# Altium project Lancelot_prj.PrjPCB (part 1 of 2)
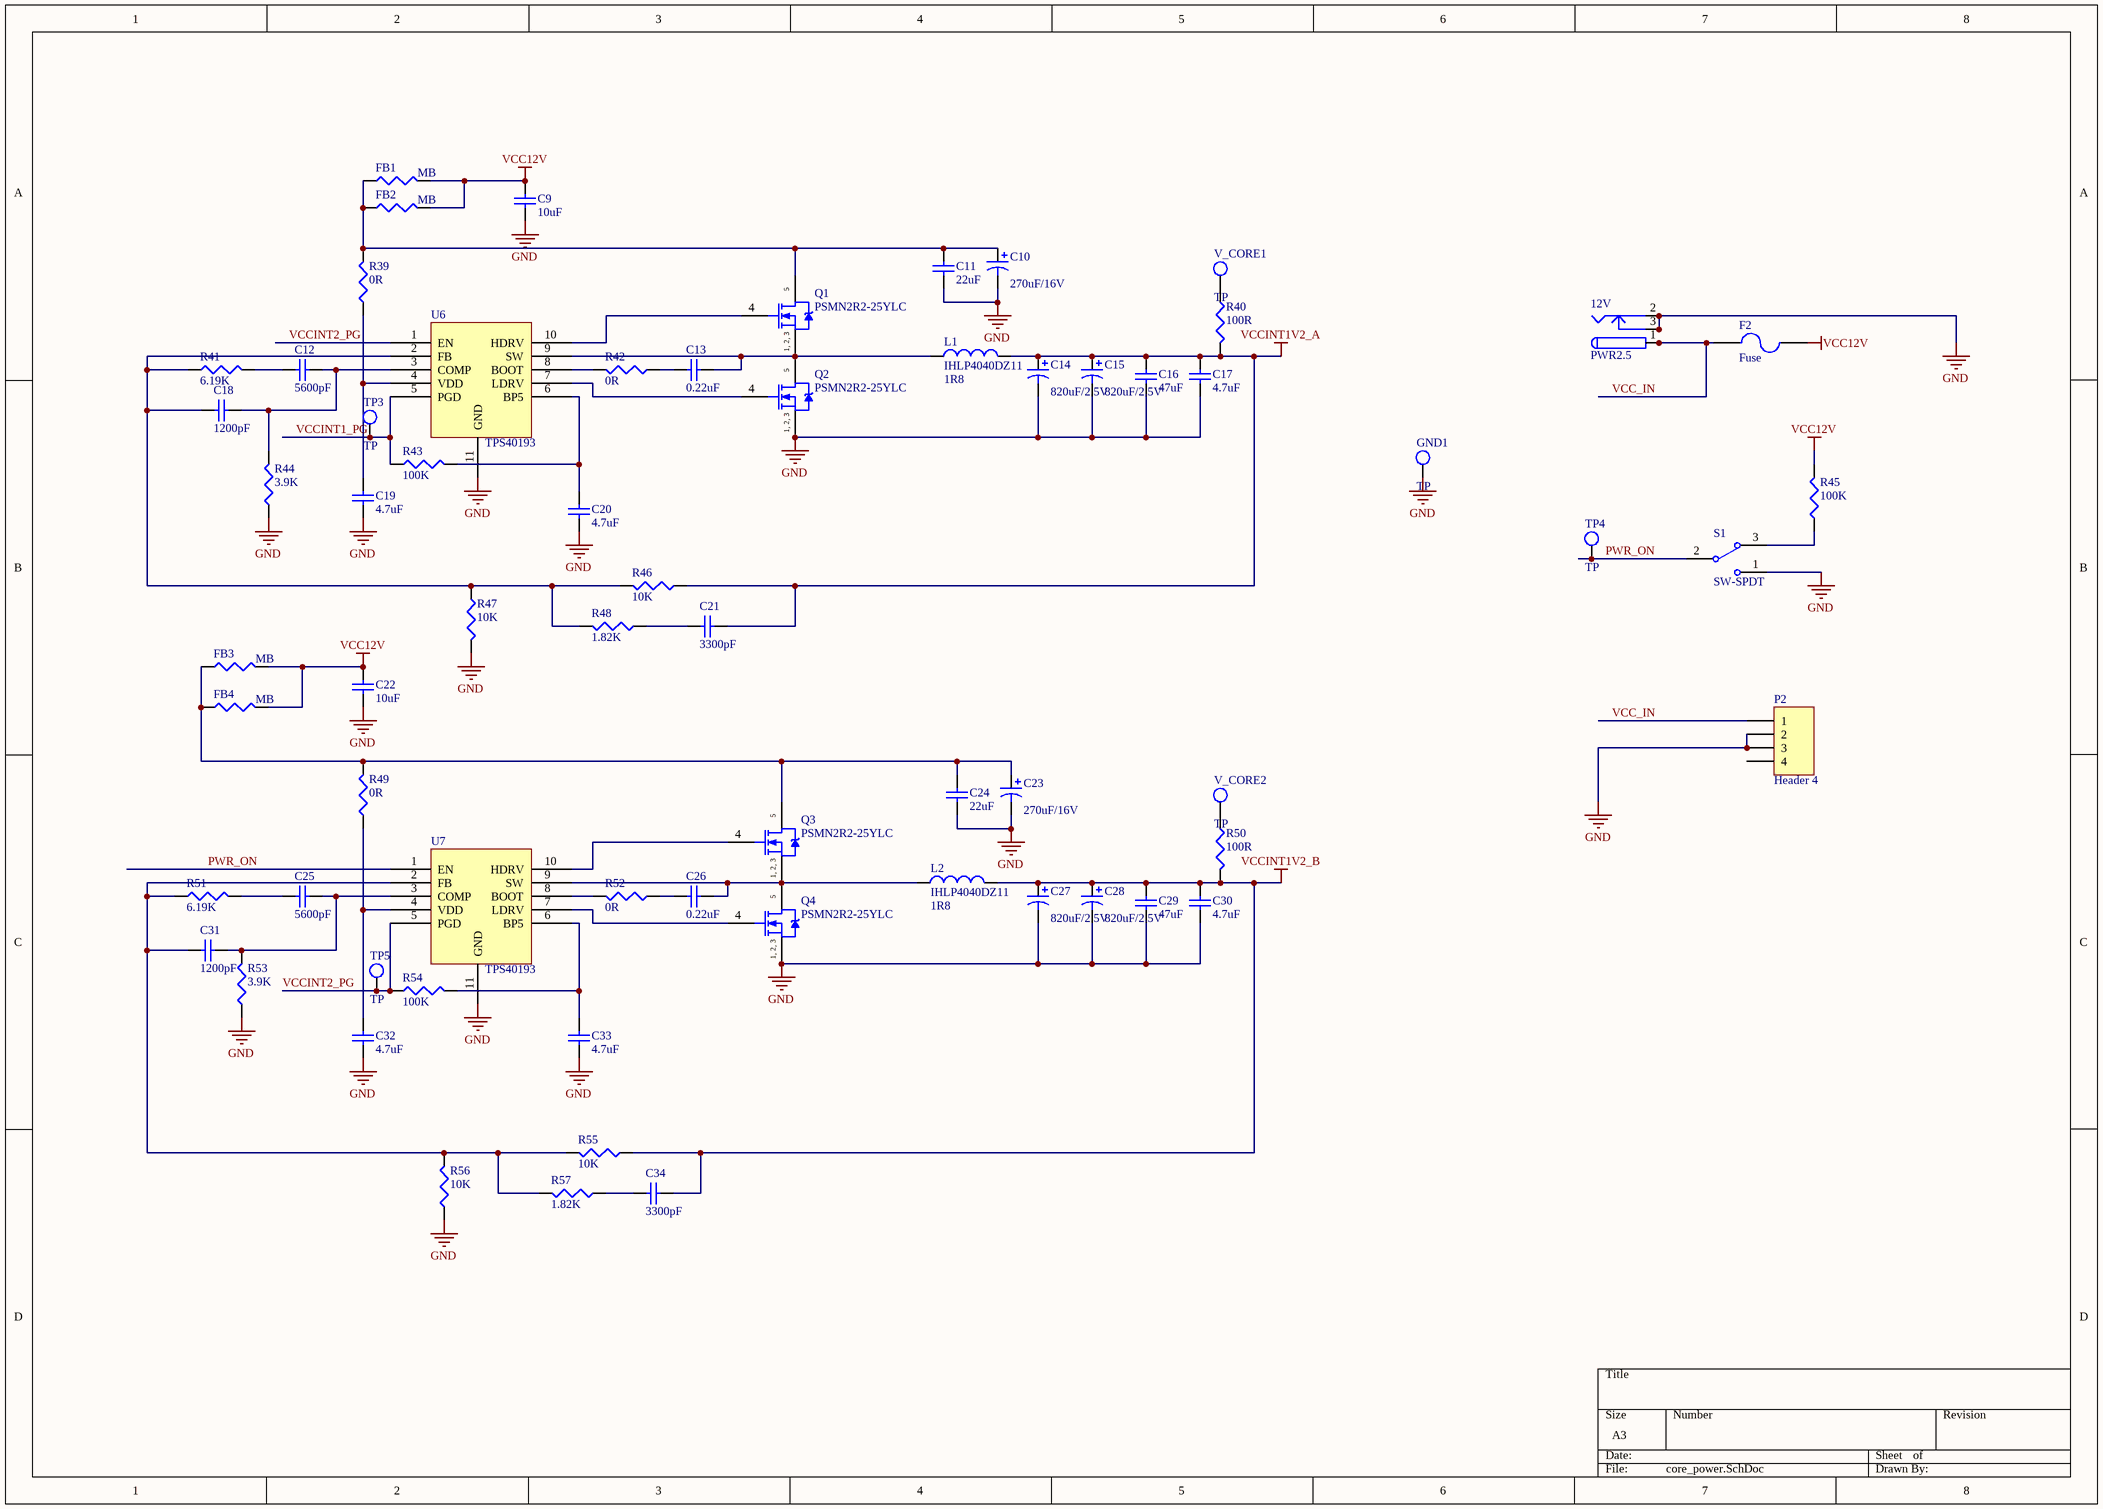
[diagram p0: core_power.SchDoc]
11 sheets, 372 parts. Net scope: global (net labels, ports and power ports of the same name join across sheets).
Board file: Lancelot.PcbDoc
Sheets:
  core_power.SchDoc
  io_power.SchDoc
  clock.SchDoc
  USB_UART.SchDoc
  peripherals.SchDoc
  config.SchDoc
  FPGA1.SchDoc
  FPGA2.SchDoc
  FPGA1_PWR.SchDoc
  FPGA2_PWR.SchDoc
  connector.SchDoc

## Sheet core_power.SchDoc
size A3

### Parts
12V  PWR2.5  [KLD-0202]
C9  10uF  [CAPC3216N]
C10  270uF/16V  [CAP8X8]
C11  22uF  [CAPC3225N]
C12  5600pF  [CAPC1608N]
C13  0.22uF  [CAPC1608N]
C14  820uF/2.5V  [CAP8X8]
C15  820uF/2.5V  [CAP8X8]
C16  47uF  [CAPC3225N]
C17  4.7uF  [CAPC1608N]
C18  1200pF  [CAPC1608N]
C19  4.7uF  [CAPC2012N]
C20  4.7uF  [CAPC2012N]
C21  3300pF  [CAPC1608N]
C22  10uF  [CAPC3216N]
C23  270uF/16V  [CAP8X8]
C24  22uF  [CAPC3225N]
C25  5600pF  [CAPC1608N]
C26  0.22uF  [CAPC1608N]
C27  820uF/2.5V  [CAP8X8]
C28  820uF/2.5V  [CAP8X8]
C29  47uF  [CAPC3225N]
C30  4.7uF  [CAPC1608N]
C31  1200pF  [CAPC1608N]
C32  4.7uF  [CAPC2012N]
C33  4.7uF  [CAPC2012N]
C34  3300pF  [CAPC1608N]
F2  Fuse  [RESC5025N]
FB1  MB  [INDC3216N]
FB2  MB  [INDC3216N]
FB3  MB  [INDC3216N]
FB4  MB  [INDC3216N]
GND1  TP  [PIN1]
L1  IHLP4040DZ11  value 1R8  [IHLP4040]
L2  IHLP4040DZ11  value 1R8  [IHLP4040]
P2  Header 4  [015244441]
Q1  PSMN2R2-25YLC  [LFPAK]
Q2  PSMN2R2-25YLC  [LFPAK]
Q3  PSMN2R2-25YLC  [LFPAK]
Q4  PSMN2R2-25YLC  [LFPAK]
R39  0R  [RESC1608N]
R40  100R  [RESC1005N]
R41  6.19K  [RESC1608N]
R42  0R  [RESC1608N]
R43  100K  [RESC1005N]
R44  3.9K  [RESC1608N]
R45  100K  [RESC1005N]
R46  10K  [RESC1608N]
R47  10K  [RESC1608N]
R48  1.82K  [RESC1608N]
R49  0R  [RESC1608N]
R50  100R  [RESC1005N]
R51  6.19K  [RESC1608N]
R52  0R  [RESC1608N]
R53  3.9K  [RESC1608N]
R54  100K  [RESC1005N]
R55  10K  [RESC1608N]
R56  10K  [RESC1608N]
R57  1.82K  [RESC1608N]
S1  SW-SPDT  [SW3_S]
TP3  TP  [TP]
TP4  TP  [TP]
TP5  TP  [TP]
U6  TPS40193  [SON10]
U7  TPS40193  [SON10]
V_CORE1  TP  [PIN1]
V_CORE2  TP  [PIN1]

### Nets
GND: 12V.2 12V.2A 12V.2B 12V.3 12V.3A 12V.3B C9.1 C10.2 C11.1 C14.2 C15.2 C16.1 C17.1 C19.2 C20.1 C22.1 C23.2 C24.1 C27.2 C28.2 C29.1 C30.1 C32.1 C33.2 GND1.1(TP) P2.2 P2.3 Q2.1(S) Q2.2(S) Q2.3(S) Q4.1(S) Q4.2(S) Q4.3(S) R44.1 R47.2 R53.1 R56.1 S1.1 U6.11(GND) U7.11(GND)
VCC12V: C9.2 C22.2 F2.2 FB1.2 FB2.2 FB3.2 FB4.2 R45.2
VCCINT1V2_A: C14.1 C15.1 C16.2 C17.2 C21.2 L1.2 R40.2 R46.1
VCCINT1V2_B: C27.1 C28.1 C29.2 C30.2 C34.2 L2.2 R50.2 R55.1
PWR_ON: S1.2 TP4.1(TP) U7.1(EN)
VCC_IN: 12V.1 12V.1A 12V.1B F2.1 P2.1
VCCINT1_PG: R43.1 TP3.1(TP) U6.5(PGD)
VCCINT2_PG: R54.1 TP5.1(TP) U6.1(EN) U7.5(PGD)
NetC10_1: C10.1 C11.2 FB1.1 FB2.1 Q1.5(D) R39.2
NetC12_1: C12.1 C18.1 R44.2 U6.3(COMP)
NetC12_2: C12.2 R41.2
NetC13_1: C13.1 L1.1 Q1.1(S) Q1.2(S) Q1.3(S) Q2.5(D) U6.9(SW)
NetC13_2: C13.2 R42.1
NetC18_2: C18.2 R41.1 R46.2 R47.1 R48.2 U6.2(FB)
NetC19_1: C19.1 R39.1 U6.4(VDD)
NetC20_2: C20.2 R43.2 U6.6(BP5)
NetC21_1: C21.1 R48.1
NetC23_1: C23.1 C24.2 FB3.1 FB4.1 Q3.5(D) R49.2
NetC25_1: C25.1 C31.1 R53.2 U7.3(COMP)
NetC25_2: C25.2 R51.2
NetC26_1: C26.1 L2.1 Q3.1(S) Q3.2(S) Q3.3(S) Q4.5(D) U7.9(SW)
NetC26_2: C26.2 R52.1
NetC31_2: C31.2 R51.1 R55.2 R56.2 R57.2 U7.2(FB)
NetC32_2: C32.2 R49.1 U7.4(VDD)
NetC33_1: C33.1 R54.2 U7.6(BP5)
NetC34_1: C34.1 R57.1
NetQ1_4: Q1.4(G) U6.10(HDRV)
NetQ2_4: Q2.4(G) U6.7(LDRV)
NetQ3_4: Q3.4(G) U7.10(HDRV)
NetQ4_4: Q4.4(G) U7.7(LDRV)
NetR40_1: R40.1 V_CORE1.1(TP)
NetR42_2: R42.2 U6.8(BOOT)
NetR45_1: R45.1 S1.3
NetR50_1: R50.1 V_CORE2.1(TP)
NetR52_2: R52.2 U7.8(BOOT)

Not connected (* = marked no-connect by the designer): P2 4

### Notes on the sheet
- (in symbol HAT216X) 1, 2, 3

### Library data of the parts
12V = PWR2.5: Low Voltage Power Supply Connector; Published: 17-Dec-2003; DatasheetDocument: 09-May-2002; Publisher: Altium Limited; ComponentLink1Description: Manufacturer Link; ComponentLink1URL: http://domino.kycon.com/internet/Products.html
C9 C11-C13 C16-C22 C24-C26 C29-C34 = Cap Semi: Capacitor (Semiconductor SIM Model); Published: 8-Jun-2000; LatestRevisionDate: 29-May-2009; LatestRevisionNote: IPC-7351 Footprint Added.; PackageReference: C1206; Publisher: Altium Limited; PackageDescription: Chip Capacitor
  C9 C22: Value: 10uF
  C11 C24: Value: 22uF
  C12 C25: Value: 5600pF
  C13 C26: Value: 0.22uF
  C16 C29: Value: 47uF
  C17 C19 C20 C30 C32 C33: Value: 4.7uF
  C18 C31: Value: 1200pF
  C21 C34: Value: 3300pF
C10 C14 C15 C23 C27 C28 = Cap Pol1: Polarized Capacitor (Radial); Published: 8-Jun-2000; LatestRevisionDate: 17-Jul-2002; LatestRevisionNote: Re-released for DXP Platform.; PackageReference: RB7.6-15; Publisher: Altium Limited; PackageDescription: Polarized Capacitor (Radial); 2 Leads
  C10 C23: Value: 270uF/16V
  C14 C15 C27 C28: Value: 820uF/2.5V
F2 = Fuse 2: Published: 8-Jun-2000; LatestRevisionDate: 17-Jul-2002; LatestRevisionNote: Re-released for DXP Platform.; PackageReference: PIN-W2/E2.8; Publisher: Altium Limited
FB1-FB4 R39-R57 = Res3: Resistor; Published: 8-Jun-2000; LatestRevisionDate: 29-May-2009; LatestRevisionNote: IPC-7351 Footprint Added.; PackageReference: J1-0603; Publisher: Altium Limited; PackageDescription: Chip Resistor
  FB1-FB4: Value: MB
  R39 R42 R49 R52: Value: 0R
  R40 R50: Value: 100R
  R41 R51: Value: 6.19K
  R43 R45 R54: Value: 100K
  R44 R53: Value: 3.9K
  R46 R47 R55 R56: Value: 10K
  R48 R57: Value: 1.82K
L1 L2 = Inductor: Code_IEC: 1005; Published: 8-Jun-2000; LatestRevisionDate: 29-May-2009; LatestRevisionNote: IPC-7351 Footprint Added.; PackageReference: 0402-A; Publisher: Altium Limited; PackageDescription: Chip Inductor; Code_JEITA: 0402
P2 = Header 4: Header, 4-Pin; LatestRevisionDate: 17-Jul-2002; LatestRevisionNote: Re-released for DXP Platform.; Publisher: Altium Limited
Q1-Q4 = HAT216X
S1 = SW-SPDT: SPDT Subminiature Toggle Switch, Right Angle Mounting, Vertical Actuation; Published: 24-Mar-1999; LatestRevisionDate: 17-Dec-2003; LatestRevisionNote: Schematic revised, PCB Footprint replaced.; DatasheetVersion: 05-Dec-2000; PackageReference: TL36WW15050; Publisher: Altium Limited; PackageDescription: Switch; 4 Leads; ComponentLink1Description: Manufacturer Link; ComponentLink1URL: http://www.apem.com

## Sheet io_power.SchDoc
size A4
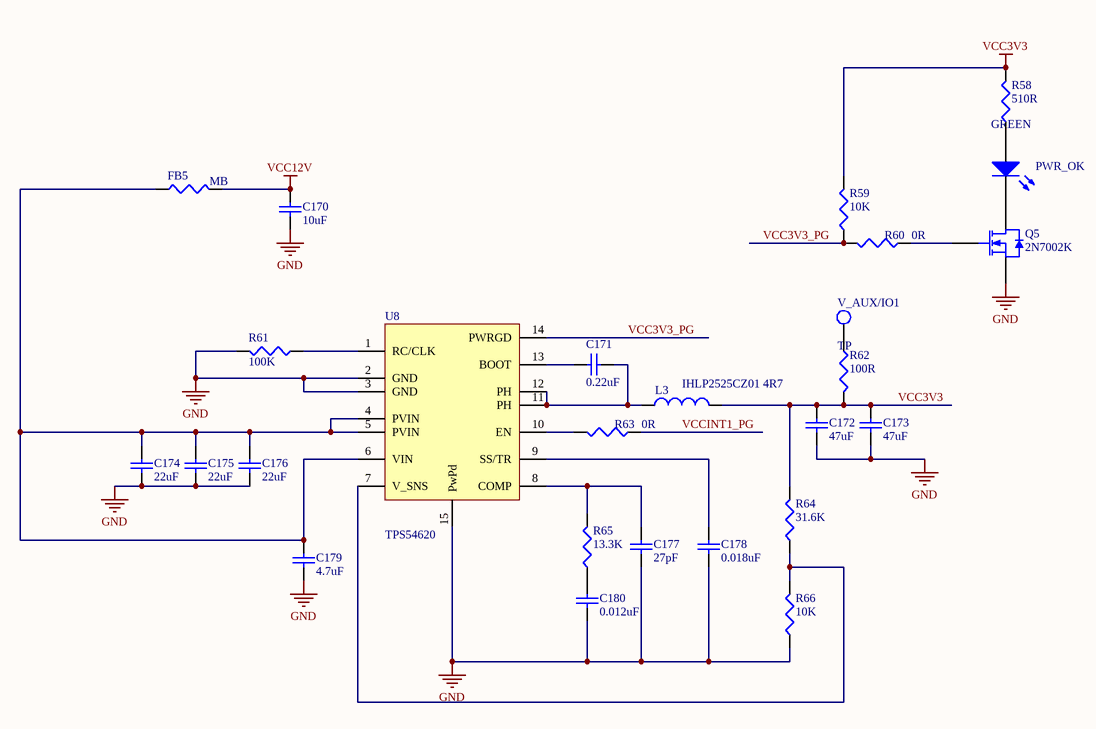
[diagram p1: io_power.SchDoc]

### Parts
C170  10uF  [CAPC3216N]
C171  0.22uF  [CAPC1608N]
C172  47uF  [CAPC3225N]
C173  47uF  [CAPC3225N]
C174  22uF  [CAPC3225N]
C175  22uF  [CAPC3225N]
C176  22uF  [CAPC3225N]
C177  27pF  [CAPC1608N]
C178  0.018uF  [CAPC1608N]
C179  4.7uF  [CAPC2012N]
C180  0.012uF  [CAPC1608N]
FB5  MB  [INDC3216N]
L3  IHLP2525CZ01  value 4R7  [IHLP2525]
PWR_OK  GREEN  [CD1608-0603]
Q5  2N7002K  [SOT23_N]
R58  510R  [RESC1005N]
R59  10K  [RESC1608N]
R60  0R  [RESC1005N]
R61  100K  [RESC1005N]
R62  100R  [RESC1005N]
R63  0R  [RESC1005N]
R64  31.6K  [RESC1608N]
R65  13.3K  [RESC1608N]
R66  10K  [RESC1608N]
U8  TPS54620  [VQFN-14]
V_AUX/IO1  TP  [PIN1]

### Nets
GND: C170.1 C172.1 C173.1 C174.1 C175.1 C176.1 C177.1 C178.1 C179.1 C180.1 Q5.2(S) R61.2 R66.1 U8.2(GND) U8.3(GND) U8.15(PwPd)
VCC3V3: C172.2 C173.2 L3.2 R58.2 R59.2 R62.2 R64.2
VCC12V: C170.2 FB5.2
VCC3V3_PG: R59.1 R60.2 U8.14(PWRGD)
VCCINT1_PG: R63.1
NetC171_1: C171.1 U8.13(BOOT)
NetC171_2: C171.2 L3.1 U8.11(PH) U8.12(PH)
NetC174_2: C174.2 C175.2 C176.2 C179.2 FB5.1 U8.4(PVIN) U8.5(PVIN) U8.6(VIN)
NetC177_2: C177.2 R65.2 U8.8(COMP)
NetC178_2: C178.2 U8.9(SS/TR)
NetC180_2: C180.2 R65.1
NetPWR_OK_1: PWR_OK.1(A) R58.1
NetPWR_OK_2: PWR_OK.2(K) Q5.3(D)
NetQ5_1: Q5.1(G) R60.1
NetR61_1: R61.1 U8.1(RC/CLK)
NetR62_1: R62.1 V_AUX/IO1.1(TP)
NetR63_2: R63.2 U8.10(EN)
NetR64_1: R64.1 R66.2 U8.7(V_SNS)

### Library data of the parts
C170 = Cap Semi: Capacitor (Semiconductor SIM Model); Published: 8-Jun-2000; LatestRevisionDate: 29-May-2009; LatestRevisionNote: IPC-7351 Footprint Added.; PackageReference: C1206; Publisher: Altium Limited; PackageDescription: Chip Capacitor; Value: 10uF
C171 C177 C178 C180 = C0603: Ceramic Chip Capacitor - Standard; Note: Footprint corresponds to dimensions for bulk cassette packaging. This case size has tightened tolerances.; Published: 17-Jul-2002; LatestRevisionDate: 19-Mar-2004; LatestRevisionNote: Silkscreen size reduced.; DatasheetDocument: Mar-2001; PackageDocument: Mar-2001; PackageReference: 0603; Publisher: Altium Limited; Code_JEITA: 0603; Code_IPC: 1608 [0603]; ComponentLink1Description: Manufacturer Link; ComponentLink1URL: http://www.kemet.com/; ComponentLink2Description: Datasheet; ComponentLink2URL: http://www.kemet.com/kemet/web/homepage/kechome.nsf/vapubfilesname/F3102TA.pdf/$file/F3102TA.pdf
  C171: Value: 0.22uF
  C177: Value: 27pF
  C178: Value: 0.018uF
  C180: Value: 0.012uF
C172-C176 = C1210: Ceramic Chip Capacitor - Standard; Published: 17-Jul-2002; LatestRevisionDate: 19-Mar-2004; LatestRevisionNote: Silkscreen size reduced.; DatasheetDocument: Mar-2001; PackageDocument: Mar-2001; PackageReference: 1210; Publisher: Altium Limited; Code_JEITA: 1210; Code_IPC: 3225 [1210]; ComponentLink1Description: Manufacturer Link; ComponentLink1URL: http://www.kemet.com/; ComponentLink2Description: Datasheet; ComponentLink2URL: http://www.kemet.com/kemet/web/homepage/kechome.nsf/vapubfilesname/F3102TA.pdf/$file/F3102TA.pdf
  C172 C173: Value: 47uF
  C174-C176: Value: 22uF
C179 = C0805: Ceramic Chip Capacitor - Standard; Note: Footprint corresponds to dimensions for bulk cassette packaging. This case size has tightened tolerances.; Published: 17-Jul-2002; LatestRevisionDate: 19-Mar-2004; LatestRevisionNote: Silkscreen size reduced.; DatasheetDocument: Mar-2001; PackageDocument: Mar-2001; PackageReference: 0805; Publisher: Altium Limited; Code_JEITA: 0805; Code_IPC: 2012[0805]; ComponentLink1Description: Manufacturer Link; ComponentLink1URL: http://www.kemet.com/; ComponentLink2Description: Datasheet; ComponentLink2URL: http://www.kemet.com/kemet/web/homepage/kechome.nsf/vapubfilesname/F3102TA.pdf/$file/F3102TA.pdf; Value: 4.7uF
FB5 R58-R66 = Res3: Resistor; Published: 8-Jun-2000; LatestRevisionDate: 29-May-2009; LatestRevisionNote: IPC-7351 Footprint Added.; PackageReference: J1-0603; Publisher: Altium Limited; PackageDescription: Chip Resistor
  FB5: Value: MB
  R58: Value: 510R
  R59 R66: Value: 10K
  R60 R63: Value: 0R
  R61: Value: 100K
  R62: Value: 100R
  R64: Value: 31.6K
  R65: Value: 13.3K
L3 = Inductor: Code_IEC: 1005; Published: 8-Jun-2000; LatestRevisionDate: 29-May-2009; LatestRevisionNote: IPC-7351 Footprint Added.; PackageReference: 0402-A; Publisher: Altium Limited; PackageDescription: Chip Inductor; Code_JEITA: 0402
PWR_OK = LED3: Typical BLUE SiC LED; Published: 8-Jun-2000; LatestRevisionDate: 17-Dec-2003; LatestRevisionNote: PCB Footprint replaced.; DatasheetVersion: 16-Apr-2002; PackageVersion: 16-Apr-2002; PackageReference: 3.5X2.8X1.9; Publisher: Altium Limited; PackageDescription: SM LED; 2 C-Bend Leads; Body 3.5 x 2.8 x 1.9 mm, inc leads (LxWxH typ)
Q5 = 2N7002: N-channel Enhancement Mode Field-effect Transistor; Published: 17-Sep-2003; LatestRevisionDate: 12-Dec-2006; LatestRevisionNote: IPC-7351 Footprint Added.; DatasheetVersion: 27-Jul-2000; PackageVersion: May-1999; PackageReference: SOT23; Publisher: Altium Limited; PackageDescription: 3-Pin SOT-23 Package 0.95 mm Pitch, 2.3 mm Lead Span; ComponentLink1Description: Manufacturer Link; ComponentLink1URL: http://www.semiconductors.philips.com/; ComponentLink2Description: Datasheet; ComponentLink2URL: http://www.semiconductors.philips.com/acrobat/datasheets/2N7002_4.pdf

## Sheet clock.SchDoc
size A4
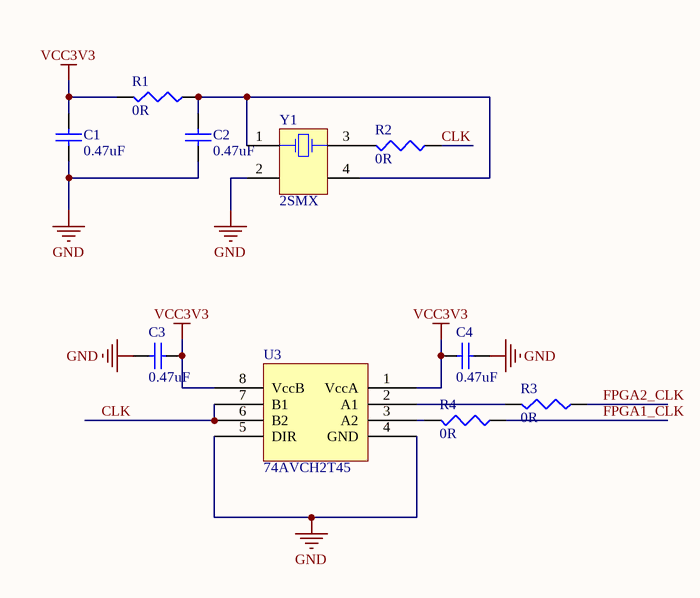
[diagram p2: clock.SchDoc]

### Parts
C1  0.47uF  [CAPC1005N]
C2  0.47uF  [CAPC1005N]
C3  0.47uF  [CAPC1005N]
C4  0.47uF  [CAPC1005N]
R1  0R  [RESC1005N]
R2  0R  [RESC1005N]
R3  0R  [RESC1005N]
R4  0R  [RESC1005N]
U3  74AVCH2T45  [SOT765-1]
Y1  2SMX  [SMX2]

### Nets
GND: C1.1 C2.1 C3.2 C4.1 U3.4(GND) U3.5(DIR) Y1.2(NC)
VCC3V3: C1.2 C3.1 C4.2 R1.2 U3.1(VccA) U3.8(VccB)
CLK: R2.1 U3.6(B2) U3.7(B1)
FPGA1_CLK: R4.1
FPGA2_CLK: R3.1
NetC2_2: C2.2 R1.1 Y1.1(OSC1) Y1.4(NC)
NetR2_2: R2.2 Y1.3(OSC2)
NetR3_2: R3.2 U3.2(A1)
NetR4_2: R4.2 U3.3(A2)

### Library data of the parts
C1-C4 = Cap Semi: Capacitor (Semiconductor SIM Model); Published: 8-Jun-2000; LatestRevisionDate: 29-May-2009; LatestRevisionNote: IPC-7351 Footprint Added.; PackageReference: C1206; Publisher: Altium Limited; PackageDescription: Chip Capacitor; Value: 0.47uF
R1-R4 = Res3: Resistor; Published: 8-Jun-2000; LatestRevisionDate: 29-May-2009; LatestRevisionNote: IPC-7351 Footprint Added.; PackageReference: J1-0603; Publisher: Altium Limited; PackageDescription: Chip Resistor; Value: 0R
Y1 = 2SMX: Surface Mount Quartz Crystal; Note: PCB layout complies with manufacturer's recommendation.; Published: 17-Jul-2002; DatasheetDocument: 9-Sep-1999; PackageDocument: 9-Sep-1999; PackageReference: 2SMX; Publisher: Altium Limited; ComponentLink1Description: Manufacturer Link; ComponentLink1URL: http://www.cmac.com/mt/

## Sheet USB_UART.SchDoc
size A4
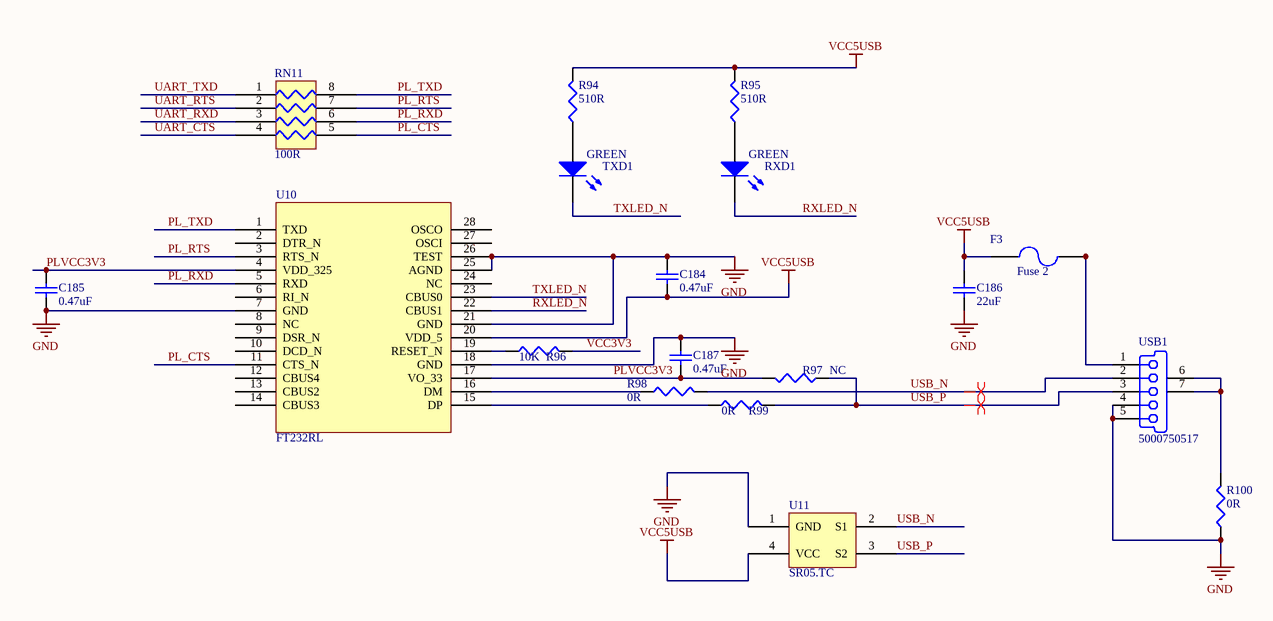
[diagram p3: USB_UART.SchDoc]

### Parts
C184  0.47uF  [CAPC1005N]
C185  0.47uF  [CAPC1005N]
C186  22uF  [CAPC3216N]
C187  0.47uF  [CAPC1005N]
F3  Fuse 2  [RESC3216N]
R94  510R  [RESC1005N]
R95  510R  [RESC1005N]
R96  10K  [RESC1005N]
R97  NC  [RESC1005N]
R98  0R  [RESC1005N]
R99  0R  [RESC1005N]
R100  0R  [RESC1608N]
RN11  100R  [EXBV8V]
RXD1  GREEN  [CD1608-0603]
TXD1  GREEN  [CD1608-0603]
U10  FT232RL  [SSOP28_N]
U11  SR05.TC  [SOT-143_N]
USB1  5000750517  [548190519]

### Nets
GND: C184.2 C185.1 C186.1 C187.2 R100.1 U10.7(GND) U10.18(GND) U10.21(GND) U10.25(AGND) U10.26(TEST) U11.1(GND) USB1.4(ID) USB1.5(GND)
VCC3V3: R96.2
VCC5USB: C184.1 C186.2 F3.1 R94.2 R95.2 U10.20(VDD_5) U11.4(VCC)
PL_CTS: RN11.5 U10.11(CTS_N)
PL_RTS: RN11.7 U10.3(RTS_N)
PL_RXD: RN11.6 U10.5(RXD)
PL_TXD: RN11.8 U10.1(TXD)
PLVCC3V3: C185.2 C187.1 R97.2 U10.4(VDD_325) U10.17(VO_33)
RXLED_N: RXD1.2(K) U10.22(CBUS1)
TXLED_N: TXD1.2(K) U10.23(CBUS0)
UART_CTS: RN11.4
UART_RTS: RN11.2
UART_RXD: RN11.3
UART_TXD: RN11.1
USB_N: R98.2 U11.2(S1) USB1.2(D-)
USB_P: R97.1 R99.2 U11.3(S2) USB1.3(D+)
NetF3_2: F3.2 USB1.1(V_BUS)
NetR94_1: R94.1 TXD1.1(A)
NetR95_1: R95.1 RXD1.1(A)
NetR96_1: R96.1 U10.19(RESET_N)
NetR98_1: R98.1 U10.16(DM)
NetR99_1: R99.1 U10.15(DP)
NetR100_2: R100.2 USB1.6(MH1) USB1.7(MH2)

Not connected (* = marked no-connect by the designer): U10 2(DTR_N) 6(RI_N) 8(NC) 9(DSR_N) 10(DCD_N) 12(CBUS4) 13(CBUS2) 14(CBUS3) 24(NC) 27(OSCI) 28(OSCO)

### Layout directives
differential pair: USB_N, USB_P

### Library data of the parts
C184-C187 = Cap Semi: Capacitor (Semiconductor SIM Model); Published: 8-Jun-2000; LatestRevisionDate: 29-May-2009; LatestRevisionNote: IPC-7351 Footprint Added.; PackageReference: C1206; Publisher: Altium Limited; PackageDescription: Chip Capacitor
  C184 C185 C187: Value: 0.47uF
  C186: Value: 22uF
F3 = Fuse 2: Fuse; Published: 8-Jun-2000; LatestRevisionDate: 17-Jul-2002; LatestRevisionNote: Re-released for DXP Platform.; PackageReference: PIN-W2/E2.8; Publisher: Altium Limited
R94-R100 = Res3: Resistor; Published: 8-Jun-2000; LatestRevisionDate: 29-May-2009; LatestRevisionNote: IPC-7351 Footprint Added.; PackageReference: J1-0603; Publisher: Altium Limited; PackageDescription: Chip Resistor
  R94 R95: Value: 510R
  R96: Value: 10K
  R97: Value: NC
  R98-R100: Value: 0R
RN11 = RES4PACK
RXD1 TXD1 = LED3: Typical BLUE SiC LED; Published: 8-Jun-2000; LatestRevisionDate: 17-Dec-2003; LatestRevisionNote: PCB Footprint replaced.; DatasheetVersion: 16-Apr-2002; PackageVersion: 16-Apr-2002; PackageReference: 3.5X2.8X1.9; Publisher: Altium Limited; PackageDescription: SM LED; 2 C-Bend Leads; Body 3.5 x 2.8 x 1.9 mm, inc leads (LxWxH typ)
U11 = SR05
USB1 = 5000750517: USB On-The-Go (OTG) Mini-B Receptacle, Right Angle, Thru-Hole, 0.80mm (.031") Pitch, Solder Tails & Shell Tabs with Dimples; PCB_Layout: Complies with Manufacturer's Recommendation.; Published: 30-May-2008; DatasheetVersion: rev0, Mar-2004; PackageVersion: rev0, Mar-2004; PackageReference: 5000750517; Publisher: Altium Limited; PackageDescription: USB Mini-B, Type 2, Thru-Hole; 5 Position; Vertical, Body 7.7 x 4.2 x 7.7 mm (LxWxH); ComponentLink1Description: Manufacturer Link; ComponentLink1URL: http://www.molex.com/; ComponentLink2Description: Datasheet; ComponentLink2URL: http://www.molex.com/pdm_docs/sd/5000750517_sd.pdf

## Sheet peripherals.SchDoc
size A3
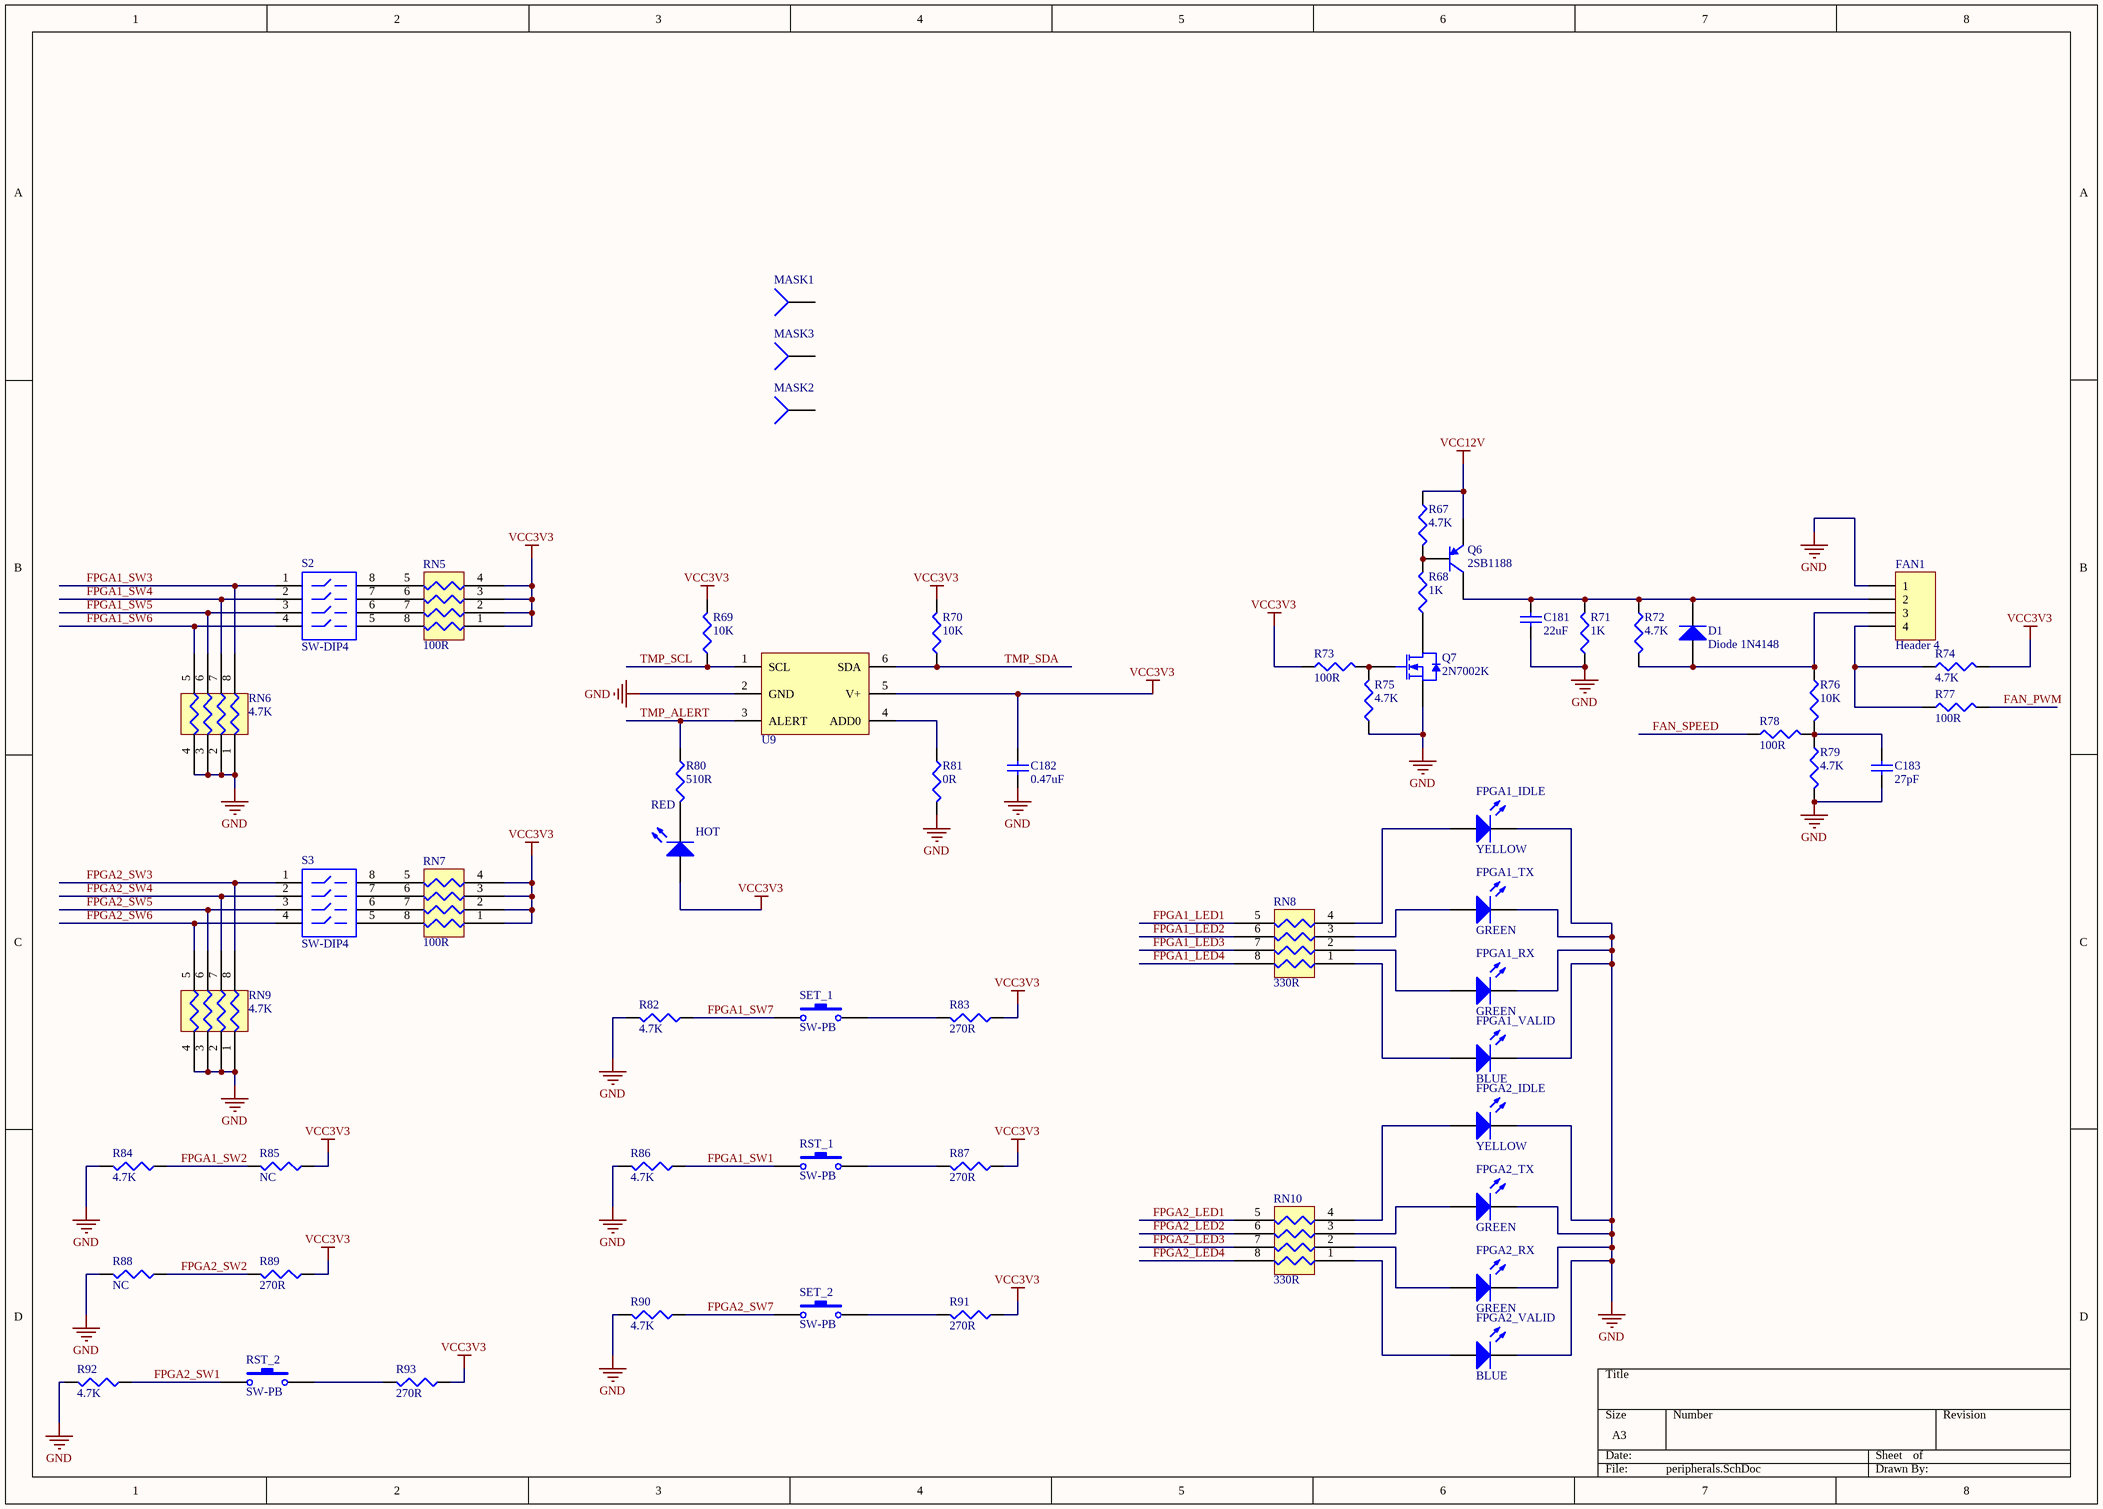
[diagram p4: peripherals.SchDoc]

### Parts
C181  22uF  [CAPC3225N]
C182  0.47uF  [CAPC1005N]
C183  27pF  [CAPC1005N]
D1  Diode 1N4148  [CD3216-1206]
FAN1  Header 4  [4PINFAN]
FPGA1_IDLE  YELLOW  [CD1608-0603]
FPGA1_RX  GREEN  [CD1608-0603]
FPGA1_TX  GREEN  [CD1608-0603]
FPGA1_VALID  BLUE  [CD1608-0603]
FPGA2_IDLE  YELLOW  [CD1608-0603]
FPGA2_RX  GREEN  [CD1608-0603]
FPGA2_TX  GREEN  [CD1608-0603]
FPGA2_VALID  BLUE  [CD1608-0603]
HOT  RED  [CD1608-0603]
MASK1  Socket  [MASK]  (value not drawn)
MASK2  Socket  [MASK]  (value not drawn)
MASK3  Socket  [MASK]  (value not drawn)
Q6  2SB1188  [SOT89M]
Q7  2N7002K  [SOT23_N]
R67  4.7K  [RESC1005N]
R68  1K  [RESC1005N]
R69  10K  [RESC1005N]
R70  10K  [RESC1005N]
R71  1K  [RESC1005N]
R72  4.7K  [RESC1005N]
R73  100R  [RESC1005N]
R74  4.7K  [RESC1005N]
R75  4.7K  [RESC1005N]
R76  10K  [RESC1005N]
R77  100R  [RESC1005N]
R78  100R  [RESC1005N]
R79  4.7K  [RESC1005N]
R80  510R  [RESC1005N]
R81  0R  [RESC1005N]
R82  4.7K  [RESC1005N]
R83  270R  [RESC1005N]
R84  4.7K  [RESC1005N]
R85  NC  [RESC1005N]
R86  4.7K  [RESC1005N]
R87  270R  [RESC1005N]
R88  NC  [RESC1005N]
R89  270R  [RESC1005N]
R90  4.7K  [RESC1005N]
R91  270R  [RESC1005N]
R92  4.7K  [RESC1005N]
R93  270R  [RESC1005N]
RN5  100R  [EXBV8V]
RN6  4.7K  [EXBV8V]
RN7  100R  [EXBV8V]
RN8  330R  [EXBV8V]
RN9  4.7K  [EXBV8V]
RN10  330R  [EXBV8V]
RST_1  SW-PB  [SKQMA]
RST_2  SW-PB  [SKQMA]
S2  SW-DIP4  [SO8W]
S3  SW-DIP4  [SO8W]
SET_1  SW-PB  [SKQMA]
SET_2  SW-PB  [SKQMA]
U9  TMP102  [SOT563]  (value not drawn)

### Nets
GND: C181.1 C182.2 C183.2 FAN1.1 FPGA1_IDLE.2(K) FPGA1_RX.2(K) FPGA1_TX.2(K) FPGA1_VALID.2(K) FPGA2_IDLE.2(K) FPGA2_RX.2(K) FPGA2_TX.2(K) FPGA2_VALID.2(K) Q7.2(S) R71.1 R75.1 R79.2 R81.2 R82.2 R84.2 R86.2 R88.2 R90.2 R92.2 RN6.1 RN6.2 RN6.3 RN6.4 RN9.1 RN9.2 RN9.3 RN9.4 U9.2(GND)
VCC3V3: C182.1 HOT.1(A) R69.2 R70.2 R73.1 R74.2 R83.1 R85.1 R87.1 R89.1 R91.1 R93.1 RN5.1 RN5.2 RN5.3 RN5.4 RN7.1 RN7.2 RN7.3 RN7.4 U9.5(V+)
VCC12V: Q6.3(E) R67.1
FAN_PWM: R77.2
FAN_SPEED: R78.1
FPGA1_LED1: RN8.5
FPGA1_LED2: RN8.6
FPGA1_LED3: RN8.7
FPGA1_LED4: RN8.8
FPGA1_SW1: R86.1 RST_1.1
FPGA1_SW2: R84.1 R85.2
FPGA1_SW3: RN6.8 S2.1
FPGA1_SW4: RN6.7 S2.2
FPGA1_SW5: RN6.6 S2.3
FPGA1_SW6: RN6.5 S2.4
FPGA1_SW7: R82.1 SET_1.1
FPGA2_LED1: RN10.5
FPGA2_LED2: RN10.6
FPGA2_LED3: RN10.7
FPGA2_LED4: RN10.8
FPGA2_SW1: R92.1 RST_2.1
FPGA2_SW2: R88.1 R89.2
FPGA2_SW3: RN9.8 S3.1
FPGA2_SW4: RN9.7 S3.2
FPGA2_SW5: RN9.6 S3.3
FPGA2_SW6: RN9.5 S3.4
FPGA2_SW7: R90.1 SET_2.1
TMP_ALERT: R80.1 U9.3(ALERT)
TMP_SCL: R69.1 U9.1(SCL)
TMP_SDA: R70.1 U9.6(SDA)
NetC181_2: C181.2 D1.2(K) FAN1.2 Q6.1(C) R71.2 R72.1
NetC183_1: C183.1 R76.2 R78.2 R79.1
NetD1_1: D1.1(A) FAN1.3 R72.2 R76.1
NetFAN1_4: FAN1.4 R74.1 R77.1
NetFPGA1_IDLE_1: FPGA1_IDLE.1(A) RN8.4
NetFPGA1_RX_1: FPGA1_RX.1(A) RN8.2
NetFPGA1_TX_1: FPGA1_TX.1(A) RN8.3
NetFPGA1_VALID_1: FPGA1_VALID.1(A) RN8.1
NetFPGA2_IDLE_1: FPGA2_IDLE.1(A) RN10.4
NetFPGA2_RX_1: FPGA2_RX.1(A) RN10.2
NetFPGA2_TX_1: FPGA2_TX.1(A) RN10.3
NetFPGA2_VALID_1: FPGA2_VALID.1(A) RN10.1
NetHOT_2: HOT.2(K) R80.2
NetQ6_2: Q6.2(B) R67.2 R68.2
NetQ7_1: Q7.1(G) R73.2 R75.2
NetQ7_3: Q7.3(D) R68.1
NetR81_1: R81.1 U9.4(ADD0)
NetR83_2: R83.2 SET_1.2
NetR87_2: R87.2 RST_1.2
NetR91_2: R91.2 SET_2.2
NetR93_2: R93.2 RST_2.2
NetRN5_5: RN5.5 S2.8
NetRN5_6: RN5.6 S2.7
NetRN5_7: RN5.7 S2.6
NetRN5_8: RN5.8 S2.5
NetRN7_5: RN7.5 S3.8
NetRN7_6: RN7.6 S3.7
NetRN7_7: RN7.7 S3.6
NetRN7_8: RN7.8 S3.5

Not connected (* = marked no-connect by the designer): MASK1 1; MASK2 1; MASK3 1

### Library data of the parts
C181-C183 = Cap Semi: Capacitor (Semiconductor SIM Model); Published: 8-Jun-2000; LatestRevisionDate: 29-May-2009; LatestRevisionNote: IPC-7351 Footprint Added.; PackageReference: C1206; Publisher: Altium Limited; PackageDescription: Chip Capacitor
  C181: Value: 22uF
  C182: Value: 0.47uF
  C183: Value: 27pF
D1 = Diode 1N4148: High Conductance Fast Diode; Published: 8-Jun-2000; LatestRevisionDate: 17-Jul-2002; LatestRevisionNote: Re-released for DXP Platform.; DatasheetVersion: 1997; PackageReference: DO-35; Publisher: Altium Limited; PackageDescription: Diode, Axial; Body 3.8 x 1.9 mm (LxDia. max), Lead Dia. 0.53 mm (max); Code_JEDEC: DO-204-AH; ComponentLink1Description: Manufacturer Link; ComponentLink1URL: http://www.fairchildsemi.com/; ComponentLink2Description: Datasheet; ComponentLink2URL: http://www.fairchildsemi.com/ds/1N%2F1N4148.pdf
FAN1 = Header 4: Header, 4-Pin; LatestRevisionDate: 17-Jul-2002; LatestRevisionNote: Re-released for DXP Platform.; Publisher: Altium Limited
FPGA1_IDLE FPGA1_RX FPGA1_TX FPGA1_VALID FPGA2_IDLE FPGA2_RX FPGA2_TX FPGA2_VALID HOT = LED3: Typical BLUE SiC LED; Published: 8-Jun-2000; LatestRevisionDate: 17-Dec-2003; LatestRevisionNote: PCB Footprint replaced.; DatasheetVersion: 16-Apr-2002; PackageVersion: 16-Apr-2002; PackageReference: 3.5X2.8X1.9; Publisher: Altium Limited; PackageDescription: SM LED; 2 C-Bend Leads; Body 3.5 x 2.8 x 1.9 mm, inc leads (LxWxH typ)
MASK1-MASK3 = Socket: pin to pad: 1>0; LatestRevisionDate: 17-Jul-2002; LatestRevisionNote: Re-released for DXP Platform.; Publisher: Altium Limited
Q6 = PNP: PNP Bipolar Transistor; pin to pad: 1>2 2>1; Published: 8-Jun-2000; LatestRevisionDate: 29-May-2009; LatestRevisionNote: IPC-7351 Footprint Added.; PackageVersion: Aug-1999; PackageReference: SOT-23B; Publisher: Altium Limited; PackageDescription: 3-Pin SOT-23 Package 0.95 mm Pitch, 2.4 mm Lead Span
Q7 = 2N7002: as Q5 on sheet io_power; Published: 17-Sep-2003; LatestRevisionDate: 12-Dec-2006; LatestRevisionNote: IPC-7351 Footprint Added.; DatasheetVersion: 27-Jul-2000; PackageVersion: May-1999; PackageReference: SOT23; Publisher: Altium Limited; PackageDescription: 3-Pin SOT-23 Package 0.95 mm Pitch, 2.3 mm Lead Span; ComponentLink1Description: Manufacturer Link; ComponentLink1URL: http://www.semiconductors.philips.com/; ComponentLink2Description: Datasheet; ComponentLink2URL: http://www.semiconductors.philips.com/acrobat/datasheets/2N7002_4.pdf
R67-R93 = Res3: Resistor; Published: 8-Jun-2000; LatestRevisionDate: 29-May-2009; LatestRevisionNote: IPC-7351 Footprint Added.; PackageReference: J1-0603; Publisher: Altium Limited; PackageDescription: Chip Resistor
  R67 R72 R74 R75 R79 R82 R84 R86 R90 R92: Value: 4.7K
  R68 R71: Value: 1K
  R69 R70 R76: Value: 10K
  R73 R77 R78: Value: 100R
  R80: Value: 510R
  R81: Value: 0R
  R83 R87 R89 R91 R93: Value: 270R
  R85 R88: Value: NC
RN5-RN10 = RES4PACK
RST_1 RST_2 SET_1 SET_2 = SW-PB: Switch; Published: 24-Mar-1999; LatestRevisionDate: 17-Jul-2002; LatestRevisionNote: Re-released for DXP Platform.; PackageReference: SPST-2; Publisher: Altium Limited; PackageDescription: Switch; 2 Leads
S2 S3 = SW-DIP4: DIP Switch; Published: 24-Mar-1999; LatestRevisionDate: 17-Jul-2002; LatestRevisionNote: Re-released for DXP Platform.; PackageReference: DIP-8; Publisher: Altium Limited

## Sheet config.SchDoc
size A3
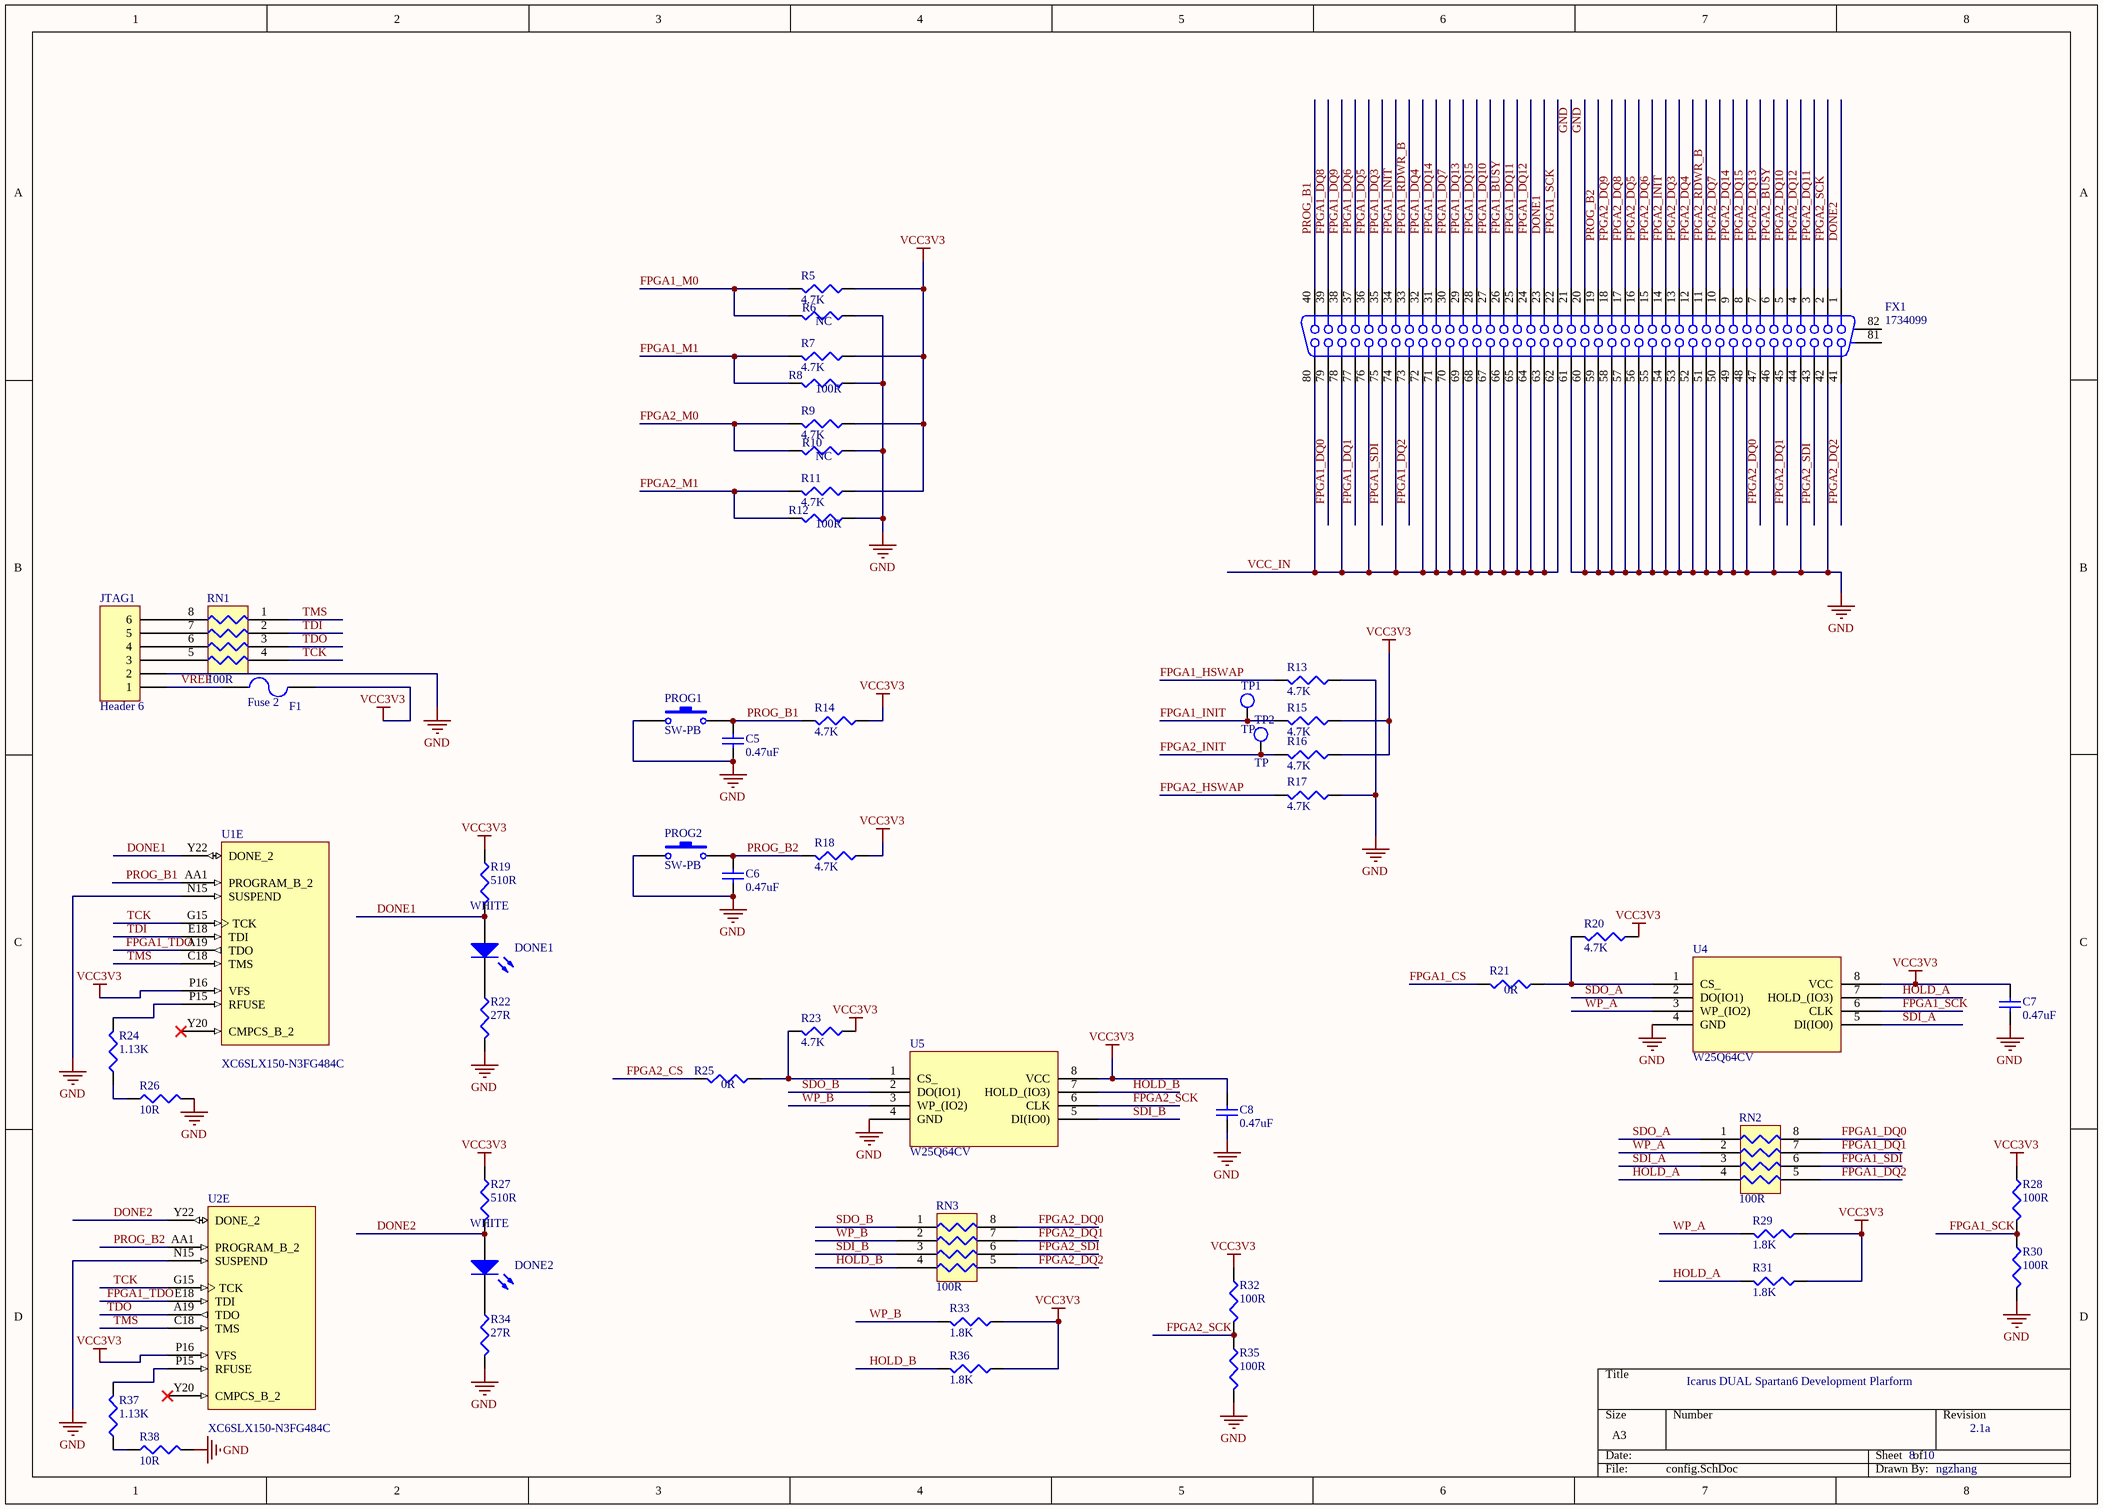
[diagram p5: config.SchDoc]

### Parts
C5  0.47uF  [CAPC1005N]
C6  0.47uF  [CAPC1005N]
C7  0.47uF  [CAPC1005N]
C8  0.47uF  [CAPC1005N]
DONE1  WHITE  [CD1608-0603]
DONE2  WHITE  [CD1608-0603]
F1  Fuse 2  [RESC3216N]
FX1  1734099  [1734099]
JTAG1  Header 6  [HDR1X6]
PROG1  SW-PB  [SKQMA]
PROG2  SW-PB  [SKQMA]
R5  4.7K  [RESC1005N]
R6  NC  [RESC1005N]
R7  4.7K  [RESC1005N]
R8  100R  [RESC1005N]
R9  4.7K  [RESC1005N]
R10  NC  [RESC1005N]
R11  4.7K  [RESC1005N]
R12  100R  [RESC1005N]
R13  4.7K  [RESC1005N]
R14  4.7K  [RESC1005N]
R15  4.7K  [RESC1005N]
R16  4.7K  [RESC1005N]
R17  4.7K  [RESC1005N]
R18  4.7K  [RESC1005N]
R19  510R  [RESC1005N]
R20  4.7K  [RESC1005N]
R21  0R  [RESC1005N]
R22  27R  [RESC1005N]
R23  4.7K  [RESC1005N]
R24  1.13K  [RESC1608N]
R25  0R  [RESC1005N]
R26  10R  [RESC1608N]
R27  510R  [RESC1005N]
R28  100R  [RESC1005N]
R29  1.8K  [RESC1005N]
R30  100R  [RESC1005N]
R31  1.8K  [RESC1005N]
R32  100R  [RESC1005N]
R33  1.8K  [RESC1005N]
R34  27R  [RESC1005N]
R35  100R  [RESC1005N]
R36  1.8K  [RESC1005N]
R37  1.13K  [RESC1608N]
R38  10R  [RESC1608N]
RN1  100R  [EXBV8V]
RN2  100R  [EXBV8V]
RN3  100R  [EXBV8V]
TP1  TP  [TP]
TP2  TP  [TP]
U1  XC6SLX150-N3FG484C  [FG484]  (part E of 7)
U2  XC6SLX150-N3FG484C  [FG484]  (part E of 7)
U4  W25Q64CV  [WSOP8]
U5  W25Q64CV  [WSOP8]

### Nets
GND: C5.2 C6.2 C7.1 C8.1 FX1.20 FX1.21 FX1.42 FX1.44 FX1.46 FX1.48 FX1.49 FX1.50 FX1.51 FX1.52 FX1.53 FX1.54 FX1.55 FX1.56 FX1.57 FX1.58 FX1.59 FX1.60 FX1.61 JTAG1.2 PROG1.1 PROG2.1 R6.1 R8.1 R10.1 R12.1 R13.1 R17.1 R22.2 R26.2 R30.2 R34.2 R35.2 R38.2 U1.N15(SUSPEND) U2.N15(SUSPEND) U4.4(GND) U5.4(GND)
VCC3V3: C7.2 C8.2 F1.2 R5.1 R7.1 R9.1 R11.1 R14.1 R15.1 R16.1 R18.1 R19.1 R20.1 R23.1 R27.1 R28.1 R29.1 R31.1 R32.1 R33.1 R36.1 U1.P16(VFS) U2.P16(VFS) U4.8(VCC) U5.8(VCC)
DONE1: DONE1.1(A) FX1.23 R19.2 U1.Y22(DONE_2)
DONE2: DONE2.1(A) FX1.1 R27.2 U2.Y22(DONE_2)
FPGA1_BUSY: FX1.26
FPGA1_CS: R21.2
FPGA1_DQ0: FX1.79 RN2.8
FPGA1_DQ1: FX1.77 RN2.7
FPGA1_DQ2: FX1.73 RN2.5
FPGA1_DQ3: FX1.35
FPGA1_DQ4: FX1.32
FPGA1_DQ5: FX1.36
FPGA1_DQ6: FX1.37
FPGA1_DQ7: FX1.30
FPGA1_DQ8: FX1.39
FPGA1_DQ9: FX1.38
FPGA1_DQ10: FX1.27
FPGA1_DQ11: FX1.25
FPGA1_DQ12: FX1.24
FPGA1_DQ13: FX1.29
FPGA1_DQ14: FX1.31
FPGA1_DQ15: FX1.28
FPGA1_HSWAP: R13.2
FPGA1_INIT: FX1.34 R15.2 TP1.1(TP)
FPGA1_M0: R5.2 R6.2
FPGA1_M1: R7.2 R8.2
FPGA1_RDWR_B: FX1.33
FPGA1_SCK: FX1.22 R28.2 R30.1 U4.6(CLK)
FPGA1_SDI: FX1.75 RN2.6
FPGA1_TDO: U1.A19(TDO) U2.E18(TDI)
FPGA2_BUSY: FX1.6
FPGA2_CS: R25.2
FPGA2_DQ0: FX1.47 RN3.8
FPGA2_DQ1: FX1.45 RN3.7
FPGA2_DQ2: FX1.41 RN3.5
FPGA2_DQ3: FX1.13
FPGA2_DQ4: FX1.12
FPGA2_DQ5: FX1.16
FPGA2_DQ6: FX1.15
FPGA2_DQ7: FX1.10
FPGA2_DQ8: FX1.17
FPGA2_DQ9: FX1.18
FPGA2_DQ10: FX1.5
FPGA2_DQ11: FX1.3
FPGA2_DQ12: FX1.4
FPGA2_DQ13: FX1.7
FPGA2_DQ14: FX1.9
FPGA2_DQ15: FX1.8
FPGA2_HSWAP: R17.2
FPGA2_INIT: FX1.14 R16.2 TP2.1(TP)
FPGA2_M0: R9.2 R10.2
FPGA2_M1: R11.2 R12.2
FPGA2_RDWR_B: FX1.11
FPGA2_SCK: FX1.2 R32.2 R35.1 U5.6(CLK)
FPGA2_SDI: FX1.43 RN3.6
HOLD_A: R31.2 RN2.4 U4.7(HOLD_(IO3))
HOLD_B: R36.2 RN3.4 U5.7(HOLD_(IO3))
PROG_B1: C5.1 FX1.40 PROG1.2 R14.2 U1.AA1(PROGRAM_B_2)
PROG_B2: C6.1 FX1.19 PROG2.2 R18.2 U2.AA1(PROGRAM_B_2)
SDI_A: RN2.3 U4.5(DI(IO0))
SDI_B: RN3.3 U5.5(DI(IO0))
SDO_A: RN2.1 U4.2(DO(IO1))
SDO_B: RN3.1 U5.2(DO(IO1))
TCK: RN1.4 U1.G15(TCK) U2.G15(TCK)
TDI: RN1.2 U1.E18(TDI)
TDO: RN1.3 U2.A19(TDO)
TMS: RN1.1 U1.C18(TMS) U2.C18(TMS)
VCC_IN: FX1.62 FX1.63 FX1.64 FX1.65 FX1.66 FX1.67 FX1.68 FX1.69 FX1.70 FX1.71 FX1.72 FX1.74 FX1.76 FX1.78 FX1.80
VREF: F1.1 JTAG1.1
WP_A: R29.2 RN2.2 U4.3(WP_(IO2))
WP_B: R33.2 RN3.2 U5.3(WP_(IO2))
NetDONE1_2: DONE1.2(K) R22.1
NetDONE2_2: DONE2.2(K) R34.1
NetJTAG1_3: JTAG1.3 RN1.5
NetJTAG1_4: JTAG1.4 RN1.6
NetJTAG1_5: JTAG1.5 RN1.7
NetJTAG1_6: JTAG1.6 RN1.8
NetR20_2: R20.2 R21.1 U4.1(CS_)
NetR23_2: R23.2 R25.1 U5.1(CS_)
NetR24_1: R24.1 R26.1
NetR24_2: R24.2 U1.P15(RFUSE)
NetR37_1: R37.1 R38.1
NetR37_2: R37.2 U2.P15(RFUSE)

Not connected (* = marked no-connect by the designer): FX1 81(MH1) 82(MH2); U1 Y20(CMPCS_B_2)*; U2 Y20(CMPCS_B_2)*

### Notes on the sheet
- Icarus DUAL Spartan6 Development Plarform
- 8
- 10
- 2.1a
- ngzhang

### Library data of the parts
C5-C8 = Cap Semi: Capacitor (Semiconductor SIM Model); Published: 8-Jun-2000; LatestRevisionDate: 29-May-2009; LatestRevisionNote: IPC-7351 Footprint Added.; PackageReference: C1206; Publisher: Altium Limited; PackageDescription: Chip Capacitor; Value: 0.47uF
DONE1 DONE2 = LED3: Typical BLUE SiC LED; Published: 8-Jun-2000; LatestRevisionDate: 17-Dec-2003; LatestRevisionNote: PCB Footprint replaced.; DatasheetVersion: 16-Apr-2002; PackageVersion: 16-Apr-2002; PackageReference: 3.5X2.8X1.9; Publisher: Altium Limited; PackageDescription: SM LED; 2 C-Bend Leads; Body 3.5 x 2.8 x 1.9 mm, inc leads (LxWxH typ)
F1 = Fuse 2: Fuse; Published: 8-Jun-2000; LatestRevisionDate: 17-Jul-2002; LatestRevisionNote: Re-released for DXP Platform.; PackageReference: PIN-W2/E2.8; Publisher: Altium Limited
JTAG1 = Header 6: Header, 6-Pin; LatestRevisionDate: 17-Jul-2002; LatestRevisionNote: Re-released for DXP Platform.; Publisher: Altium Limited
PROG1 PROG2 = SW-PB: Switch; Published: 24-Mar-1999; LatestRevisionDate: 17-Jul-2002; LatestRevisionNote: Re-released for DXP Platform.; PackageReference: SPST-2; Publisher: Altium Limited; PackageDescription: Switch; 2 Leads
R5-R38 = Res3: Resistor; Published: 8-Jun-2000; LatestRevisionDate: 29-May-2009; LatestRevisionNote: IPC-7351 Footprint Added.; PackageReference: J1-0603; Publisher: Altium Limited; PackageDescription: Chip Resistor
  R5 R7 R9 R11 R13-R18 R20 R23: Value: 4.7K
  R6 R10: Value: NC
  R8 R12 R28 R30 R32 R35: Value: 100R
  R19 R27: Value: 510R
  R21 R25: Value: 0R
  R22 R34: Value: 27R
  R24 R37: Value: 1.13K
  R26 R38: Value: 10R
  R29 R31 R33 R36: Value: 1.8K
RN1-RN3 = RES4PACK
U1 U2 = XC6SLX150-N3FG484C: Spartan-6 LX 1.2V FPGA, 338 User I/Os, 484-Ball Fine-Pitch BGA (1.0mm Pitch), Speed Grade 3N, Commercial Grade; Published: 24-Aug-2010; DatasheetVersion: ver1.6, Nov-2010; PackageVersion: ver1.1, Dec-2008; PackageReference: FG484; Publisher: Altium Limited; PackageDescription: 484-Ball Fine Pitch Ball Grid Array 1.00 mm Pitch (FG484); Code_JEDEC: MS-034-AAJ-1; Code_IPC: BGA100P22X22-484; ComponentLink1Description: Manufacturer Link; ComponentLink1URL: http://www.xilinx.com; ComponentLink2Description: Spartan-6 Datasheet; ComponentLink2URL: http://www.xilinx.com/support/documentation/data_sheets/ds160.pdf; ComponentLink3Description: Spartan-6 Documents; ComponentLink3URL: http://www.xilinx.com/support/documentation/spartan-6.htm; ComponentLink4Description: Xilinx.com Home; ComponentLink4URL: http://www.xilinx.com

## Sheet FPGA1.SchDoc
size A3
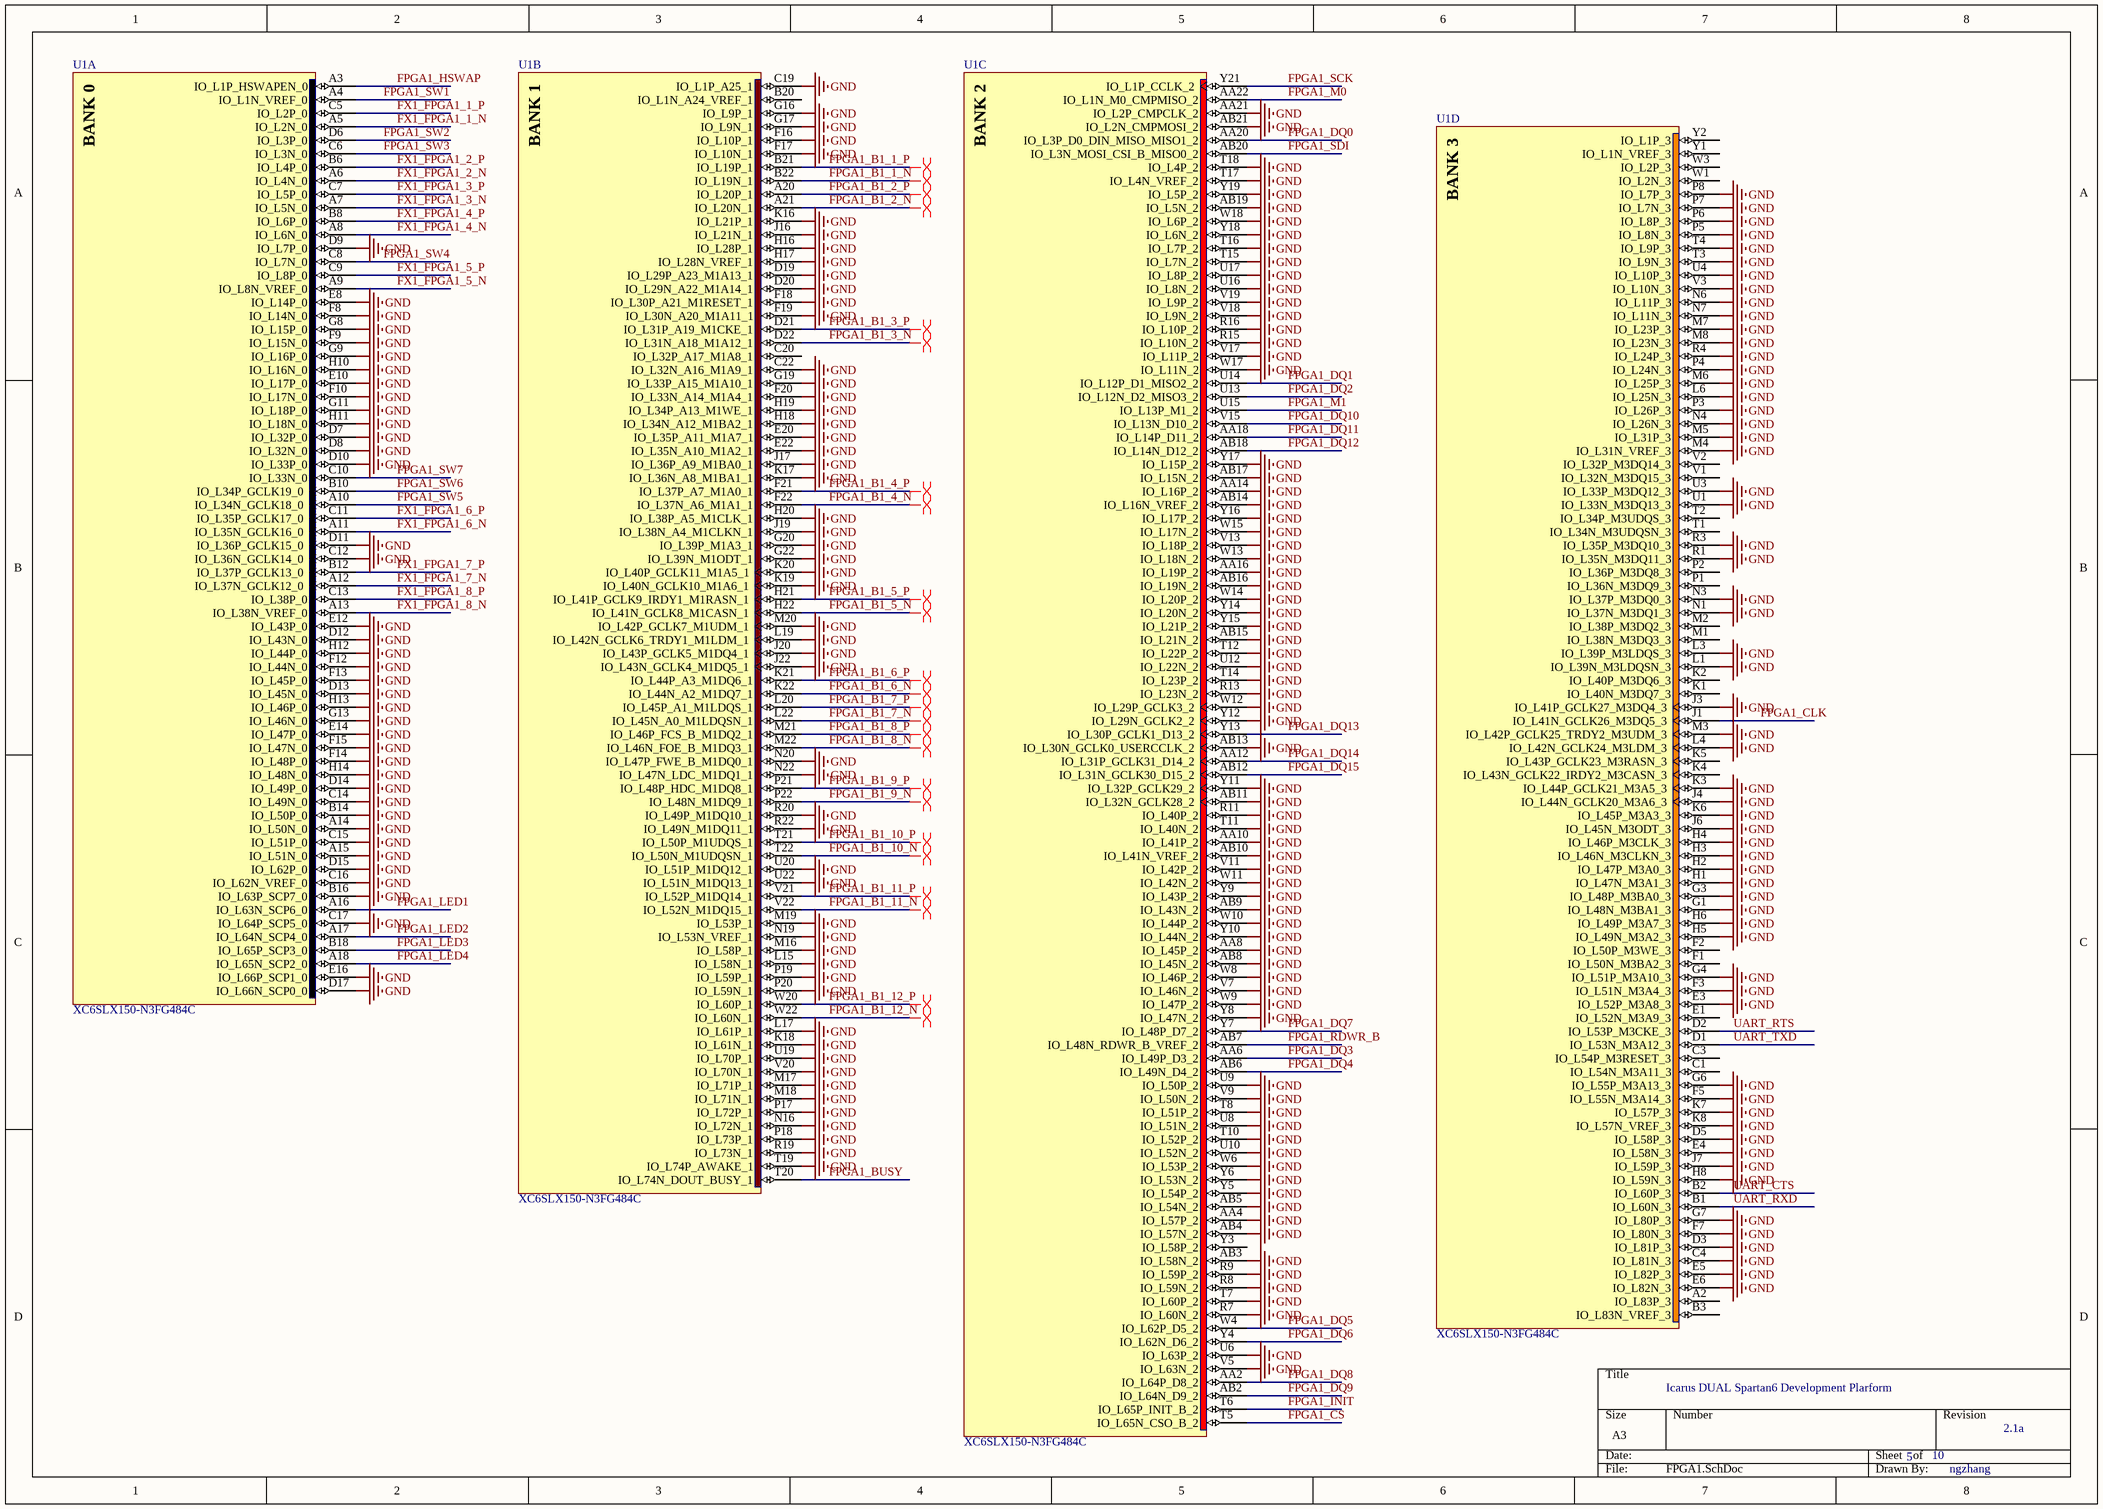
[diagram p6: FPGA1.SchDoc]

### Parts
U1  XC6SLX150-N3FG484C  [FG484]  (parts A,B,C,D of 7)

### Nets
GND: U1.A14(IO_L50N_0) U1.A15(IO_L51N_0) U1.AA4(IO_L57P_2) U1.AA8(IO_L45P_2) U1.AA10(IO_L41P_2) U1.AA14(IO_L16P_2) U1.AA16(IO_L19P_2) U1.AA21(IO_L2P_CMPCLK_2) U1.AB3(IO_L58N_2) U1.AB4(IO_L57N_2) U1.AB5(IO_L54N_2) U1.AB8(IO_L45N_2) U1.AB9(IO_L43N_2) U1.AB10(IO_L41N_VREF_2) U1.AB11(IO_L32N_GCLK28_2) U1.AB13(IO_L30N_GCLK0_USERCCLK_2) U1.AB14(IO_L16N_VREF_2) U1.AB15(IO_L21N_2) U1.AB16(IO_L19N_2) U1.AB17(IO_L15N_2) U1.AB19(IO_L5N_2) U1.AB21(IO_L2N_CMPMOSI_2) U1.B14(IO_L50P_0) U1.B16(IO_L63P_SCP7_0) U1.C4(IO_L81N_3) U1.C12(IO_L36N_GCLK14_0) U1.C14(IO_L49N_0) U1.C15(IO_L51P_0) U1.C16(IO_L62N_VREF_0) U1.C17(IO_L64P_SCP5_0) U1.C19(IO_L1P_A25_1) U1.C22(IO_L32N_A16_M1A9_1) U1.D3(IO_L81P_3) U1.D5(IO_L58P_3) U1.D7(IO_L32P_0) U1.D8(IO_L32N_0) U1.D9(IO_L7P_0) U1.D10(IO_L33P_0) U1.D11(IO_L36P_GCLK15_0) U1.D12(IO_L43N_0) U1.D13(IO_L45N_0) U1.D14(IO_L49P_0) U1.D15(IO_L62P_0) U1.D17(IO_L66N_SCP0_0) U1.D19(IO_L29P_A23_M1A13_1) U1.D20(IO_L29N_A22_M1A14_1) U1.E3(IO_L52P_M3A8_3) U1.E4(IO_L58N_3) U1.E5(IO_L82P_3) U1.E6(IO_L82N_3) U1.E8(IO_L14P_0) U1.E10(IO_L17P_0) U1.E12(IO_L43P_0) U1.E14(IO_L47P_0) U1.E16(IO_L66P_SCP1_0) U1.E20(IO_L35P_A11_M1A7_1) U1.E22(IO_L35N_A10_M1A2_1) U1.F3(IO_L51N_M3A4_3) U1.F5(IO_L55N_M3A14_3) U1.F7(IO_L80N_3) U1.F8(IO_L14N_0) U1.F9(IO_L15N_0) U1.F10(IO_L17N_0) U1.F12(IO_L44N_0) U1.F13(IO_L45P_0) U1.F14(IO_L48P_0) U1.F15(IO_L47N_0) U1.F16(IO_L10P_1) U1.F17(IO_L10N_1) U1.F18(IO_L30P_A21_M1RESET_1) U1.F19(IO_L30N_A20_M1A11_1) U1.F20(IO_L33N_A14_M1A4_1) U1.G1(IO_L48N_M3BA1_3) U1.G3(IO_L48P_M3BA0_3) U1.G4(IO_L51P_M3A10_3) U1.G6(IO_L55P_M3A13_3) U1.G7(IO_L80P_3) U1.G8(IO_L15P_0) U1.G9(IO_L16P_0) U1.G11(IO_L18P_0) U1.G13(IO_L46N_0) U1.G16(IO_L9P_1) U1.G17(IO_L9N_1) U1.G19(IO_L33P_A15_M1A10_1) U1.G20(IO_L39P_M1A3_1) U1.G22(IO_L39N_M1ODT_1) U1.H1(IO_L47N_M3A1_3) U1.H2(IO_L47P_M3A0_3) U1.H3(IO_L46N_M3CLKN_3) U1.H4(IO_L46P_M3CLK_3) U1.H5(IO_L49N_M3A2_3) U1.H6(IO_L49P_M3A7_3) U1.H8(IO_L59N_3) U1.H10(IO_L16N_0) U1.H11(IO_L18N_0) U1.H12(IO_L44P_0) U1.H13(IO_L46P_0) U1.H14(IO_L48N_0) U1.H16(IO_L28P_1) U1.H17(IO_L28N_VREF_1) U1.H18(IO_L34N_A12_M1BA2_1) U1.H19(IO_L34P_A13_M1WE_1) U1.H20(IO_L38P_A5_M1CLK_1) U1.J3(IO_L41P_GCLK27_M3DQ4_3) U1.J4(IO_L44N_GCLK20_M3A6_3) U1.J6(IO_L45N_M3ODT_3) U1.J7(IO_L59P_3) U1.J16(IO_L21N_1) U1.J17(IO_L36P_A9_M1BA0_1) U1.J19(IO_L38N_A4_M1CLKN_1) U1.J20(IO_L43P_GCLK5_M1DQ4_1) U1.J22(IO_L43N_GCLK4_M1DQ5_1) U1.K3(IO_L44P_GCLK21_M3A5_3) U1.K6(IO_L45P_M3A3_3) U1.K7(IO_L57P_3) U1.K8(IO_L57N_VREF_3) U1.K16(IO_L21P_1) U1.K17(IO_L36N_A8_M1BA1_1) U1.K18(IO_L61N_1) U1.K19(IO_L40N_GCLK10_M1A6_1) U1.K20(IO_L40P_GCLK11_M1A5_1) U1.L1(IO_L39N_M3LDQSN_3) U1.L3(IO_L39P_M3LDQS_3) U1.L4(IO_L42N_GCLK24_M3LDM_3) U1.L6(IO_L25N_3) U1.L15(IO_L58N_1) U1.L17(IO_L61P_1) U1.L19(IO_L42N_GCLK6_TRDY1_M1LDM_1) U1.M3(IO_L42P_GCLK25_TRDY2_M3UDM_3) U1.M4(IO_L31N_VREF_3) U1.M5(IO_L31P_3) U1.M6(IO_L25P_3) U1.M7(IO_L23P_3) U1.M8(IO_L23N_3) U1.M16(IO_L58P_1) U1.M17(IO_L71P_1) U1.M18(IO_L71N_1) U1.M19(IO_L53P_1) U1.M20(IO_L42P_GCLK7_M1UDM_1) U1.N1(IO_L37N_M3DQ1_3) U1.N3(IO_L37P_M3DQ0_3) U1.N4(IO_L26N_3) U1.N6(IO_L11P_3) U1.N7(IO_L11N_3) U1.N16(IO_L72N_1) U1.N19(IO_L53N_VREF_1) U1.N20(IO_L47P_FWE_B_M1DQ0_1) U1.N22(IO_L47N_LDC_M1DQ1_1) U1.P3(IO_L26P_3) U1.P4(IO_L24N_3) U1.P5(IO_L8N_3) U1.P6(IO_L8P_3) U1.P7(IO_L7N_3) U1.P8(IO_L7P_3) U1.P17(IO_L72P_1) U1.P18(IO_L73P_1) U1.P19(IO_L59P_1) U1.P20(IO_L59N_1) U1.R1(IO_L35N_M3DQ11_3) U1.R3(IO_L35P_M3DQ10_3) U1.R4(IO_L24P_3) U1.R7(IO_L60N_2) U1.R8(IO_L59N_2) U1.R9(IO_L59P_2) U1.R11(IO_L40P_2) U1.R13(IO_L23N_2) U1.R15(IO_L10N_2) U1.R16(IO_L10P_2) U1.R19(IO_L73N_1) U1.R20(IO_L49P_M1DQ10_1) U1.R22(IO_L49N_M1DQ11_1) U1.T3(IO_L9N_3) U1.T4(IO_L9P_3) U1.T7(IO_L60P_2) U1.T8(IO_L51P_2) U1.T10(IO_L52P_2) U1.T11(IO_L40N_2) U1.T12(IO_L22P_2) U1.T14(IO_L23P_2) U1.T15(IO_L7N_2) U1.T16(IO_L7P_2) U1.T17(IO_L4N_VREF_2) U1.T18(IO_L4P_2) U1.T19(IO_L74P_AWAKE_1) U1.U1(IO_L33N_M3DQ13_3) U1.U3(IO_L33P_M3DQ12_3) U1.U4(IO_L10P_3) U1.U6(IO_L63P_2) U1.U8(IO_L51N_2) U1.U9(IO_L50P_2) U1.U10(IO_L52N_2) U1.U12(IO_L22N_2) U1.U16(IO_L8N_2) U1.U17(IO_L8P_2) U1.U19(IO_L70P_1) U1.U20(IO_L51P_M1DQ12_1) U1.U22(IO_L51N_M1DQ13_1) U1.V3(IO_L10N_3) U1.V5(IO_L63N_2) U1.V7(IO_L46N_2) U1.V9(IO_L50N_2) U1.V11(IO_L42P_2) U1.V13(IO_L18P_2) U1.V17(IO_L11P_2) U1.V18(IO_L9N_2) U1.V19(IO_L9P_2) U1.V20(IO_L70N_1) U1.W6(IO_L53P_2) U1.W8(IO_L46P_2) U1.W9(IO_L47P_2) U1.W10(IO_L44P_2) U1.W11(IO_L42N_2) U1.W12(IO_L29P_GCLK3_2) U1.W13(IO_L18N_2) U1.W14(IO_L20P_2) U1.W15(IO_L17N_2) U1.W17(IO_L11N_2) U1.W18(IO_L6P_2) U1.Y5(IO_L54P_2) U1.Y6(IO_L53N_2) U1.Y8(IO_L47N_2) U1.Y9(IO_L43P_2) U1.Y10(IO_L44N_2) U1.Y11(IO_L32P_GCLK29_2) U1.Y12(IO_L29N_GCLK2_2) U1.Y14(IO_L20N_2) U1.Y15(IO_L21P_2) U1.Y16(IO_L17P_2) U1.Y17(IO_L15P_2) U1.Y18(IO_L6N_2) U1.Y19(IO_L5P_2)
FPGA1_B1_1_N: U1.B22(IO_L19N_1)
FPGA1_B1_1_P: U1.B21(IO_L19P_1)
FPGA1_B1_2_N: U1.A21(IO_L20N_1)
FPGA1_B1_2_P: U1.A20(IO_L20P_1)
FPGA1_B1_3_N: U1.D22(IO_L31N_A18_M1A12_1)
FPGA1_B1_3_P: U1.D21(IO_L31P_A19_M1CKE_1)
FPGA1_B1_4_N: U1.F22(IO_L37N_A6_M1A1_1)
FPGA1_B1_4_P: U1.F21(IO_L37P_A7_M1A0_1)
FPGA1_B1_5_N: U1.H22(IO_L41N_GCLK8_M1CASN_1)
FPGA1_B1_5_P: U1.H21(IO_L41P_GCLK9_IRDY1_M1RASN_1)
FPGA1_B1_6_N: U1.K22(IO_L44N_A2_M1DQ7_1)
FPGA1_B1_6_P: U1.K21(IO_L44P_A3_M1DQ6_1)
FPGA1_B1_7_N: U1.L22(IO_L45N_A0_M1LDQSN_1)
FPGA1_B1_7_P: U1.L20(IO_L45P_A1_M1LDQS_1)
FPGA1_B1_8_N: U1.M22(IO_L46N_FOE_B_M1DQ3_1)
FPGA1_B1_8_P: U1.M21(IO_L46P_FCS_B_M1DQ2_1)
FPGA1_B1_9_N: U1.P22(IO_L48N_M1DQ9_1)
FPGA1_B1_9_P: U1.P21(IO_L48P_HDC_M1DQ8_1)
FPGA1_B1_10_N: U1.T22(IO_L50N_M1UDQSN_1)
FPGA1_B1_10_P: U1.T21(IO_L50P_M1UDQS_1)
FPGA1_B1_11_N: U1.V22(IO_L52N_M1DQ15_1)
FPGA1_B1_11_P: U1.V21(IO_L52P_M1DQ14_1)
FPGA1_B1_12_N: U1.W22(IO_L60N_1)
FPGA1_B1_12_P: U1.W20(IO_L60P_1)
FPGA1_BUSY: U1.T20(IO_L74N_DOUT_BUSY_1)
FPGA1_CLK: U1.J1(IO_L41N_GCLK26_M3DQ5_3)
FPGA1_CS: U1.T5(IO_L65N_CSO_B_2)
FPGA1_DQ0: U1.AA20(IO_L3P_D0_DIN_MISO_MISO1_2)
FPGA1_DQ1: U1.U14(IO_L12P_D1_MISO2_2)
FPGA1_DQ2: U1.U13(IO_L12N_D2_MISO3_2)
FPGA1_DQ3: U1.AA6(IO_L49P_D3_2)
FPGA1_DQ4: U1.AB6(IO_L49N_D4_2)
FPGA1_DQ5: U1.W4(IO_L62P_D5_2)
FPGA1_DQ6: U1.Y4(IO_L62N_D6_2)
FPGA1_DQ7: U1.Y7(IO_L48P_D7_2)
FPGA1_DQ8: U1.AA2(IO_L64P_D8_2)
FPGA1_DQ9: U1.AB2(IO_L64N_D9_2)
FPGA1_DQ10: U1.V15(IO_L13N_D10_2)
FPGA1_DQ11: U1.AA18(IO_L14P_D11_2)
FPGA1_DQ12: U1.AB18(IO_L14N_D12_2)
FPGA1_DQ13: U1.Y13(IO_L30P_GCLK1_D13_2)
FPGA1_DQ14: U1.AA12(IO_L31P_GCLK31_D14_2)
FPGA1_DQ15: U1.AB12(IO_L31N_GCLK30_D15_2)
FPGA1_HSWAP: U1.A3(IO_L1P_HSWAPEN_0)
FPGA1_INIT: U1.T6(IO_L65P_INIT_B_2)
FPGA1_LED1: U1.A16(IO_L63N_SCP6_0)
FPGA1_LED2: U1.A17(IO_L64N_SCP4_0)
FPGA1_LED3: U1.B18(IO_L65P_SCP3_0)
FPGA1_LED4: U1.A18(IO_L65N_SCP2_0)
FPGA1_M0: U1.AA22(IO_L1N_M0_CMPMISO_2)
FPGA1_M1: U1.U15(IO_L13P_M1_2)
FPGA1_RDWR_B: U1.AB7(IO_L48N_RDWR_B_VREF_2)
FPGA1_SCK: U1.Y21(IO_L1P_CCLK_2)
FPGA1_SDI: U1.AB20(IO_L3N_MOSI_CSI_B_MISO0_2)
FPGA1_SW1: U1.A4(IO_L1N_VREF_0)
FPGA1_SW2: U1.D6(IO_L3P_0)
FPGA1_SW3: U1.C6(IO_L3N_0)
FPGA1_SW4: U1.C8(IO_L7N_0)
FPGA1_SW5: U1.A10(IO_L34N_GCLK18_0)
FPGA1_SW6: U1.B10(IO_L34P_GCLK19_0)
FPGA1_SW7: U1.C10(IO_L33N_0)
FX1_FPGA1_1_N: U1.A5(IO_L2N_0)
FX1_FPGA1_1_P: U1.C5(IO_L2P_0)
FX1_FPGA1_2_N: U1.A6(IO_L4N_0)
FX1_FPGA1_2_P: U1.B6(IO_L4P_0)
FX1_FPGA1_3_N: U1.A7(IO_L5N_0)
FX1_FPGA1_3_P: U1.C7(IO_L5P_0)
FX1_FPGA1_4_N: U1.A8(IO_L6N_0)
FX1_FPGA1_4_P: U1.B8(IO_L6P_0)
FX1_FPGA1_5_N: U1.A9(IO_L8N_VREF_0)
FX1_FPGA1_5_P: U1.C9(IO_L8P_0)
FX1_FPGA1_6_N: U1.A11(IO_L35N_GCLK16_0)
FX1_FPGA1_6_P: U1.C11(IO_L35P_GCLK17_0)
FX1_FPGA1_7_N: U1.A12(IO_L37N_GCLK12_0)
FX1_FPGA1_7_P: U1.B12(IO_L37P_GCLK13_0)
FX1_FPGA1_8_N: U1.A13(IO_L38N_VREF_0)
FX1_FPGA1_8_P: U1.C13(IO_L38P_0)
UART_CTS: U1.B2(IO_L60P_3)
UART_RTS: U1.D2(IO_L53P_M3CKE_3)
UART_RXD: U1.B1(IO_L60N_3)
UART_TXD: U1.D1(IO_L53N_M3A12_3)

Not connected (* = marked no-connect by the designer): U1 A2(IO_L83P_3) B3(IO_L83N_VREF_3) B20(IO_L1N_A24_VREF_1) C1(IO_L54N_M3A11_3) C3(IO_L54P_M3RESET_3) C20(IO_L32P_A17_M1A8_1) E1(IO_L52N_M3A9_3) F1(IO_L50N_M3BA2_3) F2(IO_L50P_M3WE_3) K1(IO_L40N_M3DQ7_3) K2(IO_L40P_M3DQ6_3) K4(IO_L43N_GCLK22_IRDY2_M3CASN_3) K5(IO_L43P_GCLK23_M3RASN_3) M1(IO_L38N_M3DQ3_3) M2(IO_L38P_M3DQ2_3) P1(IO_L36N_M3DQ9_3) P2(IO_L36P_M3DQ8_3) T1(IO_L34N_M3UDQSN_3) T2(IO_L34P_M3UDQS_3) V1(IO_L32N_M3DQ15_3) V2(IO_L32P_M3DQ14_3) W1(IO_L2N_3) W3(IO_L2P_3) Y1(IO_L1N_VREF_3) Y2(IO_L1P_3) Y3(IO_L58P_2)

### Layout directives
differential pair: FPGA1_B1_1_N, FPGA1_B1_1_P, FPGA1_B1_2_N, FPGA1_B1_2_P, FPGA1_B1_3_N, FPGA1_B1_3_P, FPGA1_B1_4_N, FPGA1_B1_4_P, FPGA1_B1_5_N, FPGA1_B1_5_P, FPGA1_B1_6_N, FPGA1_B1_6_P, FPGA1_B1_7_N, FPGA1_B1_7_P, FPGA1_B1_8_N, FPGA1_B1_8_P, FPGA1_B1_9_N, FPGA1_B1_9_P, FPGA1_B1_10_N, FPGA1_B1_10_P, FPGA1_B1_11_N, FPGA1_B1_11_P, FPGA1_B1_12_N, FPGA1_B1_12_P

### Notes on the sheet
- Icarus DUAL Spartan6 Development Plarform
- 5
- 10
- 2.1a
- ngzhang
- (in symbol XC6SLX150-N3FG484C, part A) BANK 0
- (in symbol XC6SLX150-N3FG484C, part B) BANK 1
- (in symbol XC6SLX150-N3FG484C, part C) BANK 2
- (in symbol XC6SLX150-N3FG484C, part D) BANK 3

### Library data of the parts
U1 = XC6SLX150-N3FG484C: as U1 on sheet config; Published: 24-Aug-2010; DatasheetVersion: ver1.6, Nov-2010; PackageVersion: ver1.1, Dec-2008; PackageReference: FG484; Publisher: Altium Limited; PackageDescription: 484-Ball Fine Pitch Ball Grid Array 1.00 mm Pitch (FG484); Code_JEDEC: MS-034-AAJ-1; Code_IPC: BGA100P22X22-484; ComponentLink1Description: Manufacturer Link; ComponentLink1URL: http://www.xilinx.com; ComponentLink2Description: Spartan-6 Datasheet; ComponentLink2URL: http://www.xilinx.com/support/documentation/data_sheets/ds160.pdf; ComponentLink3Description: Spartan-6 Documents; ComponentLink3URL: http://www.xilinx.com/support/documentation/spartan-6.htm; ComponentLink4Description: Xilinx.com Home; ComponentLink4URL: http://www.xilinx.com

## Sheet FPGA2.SchDoc
size A3
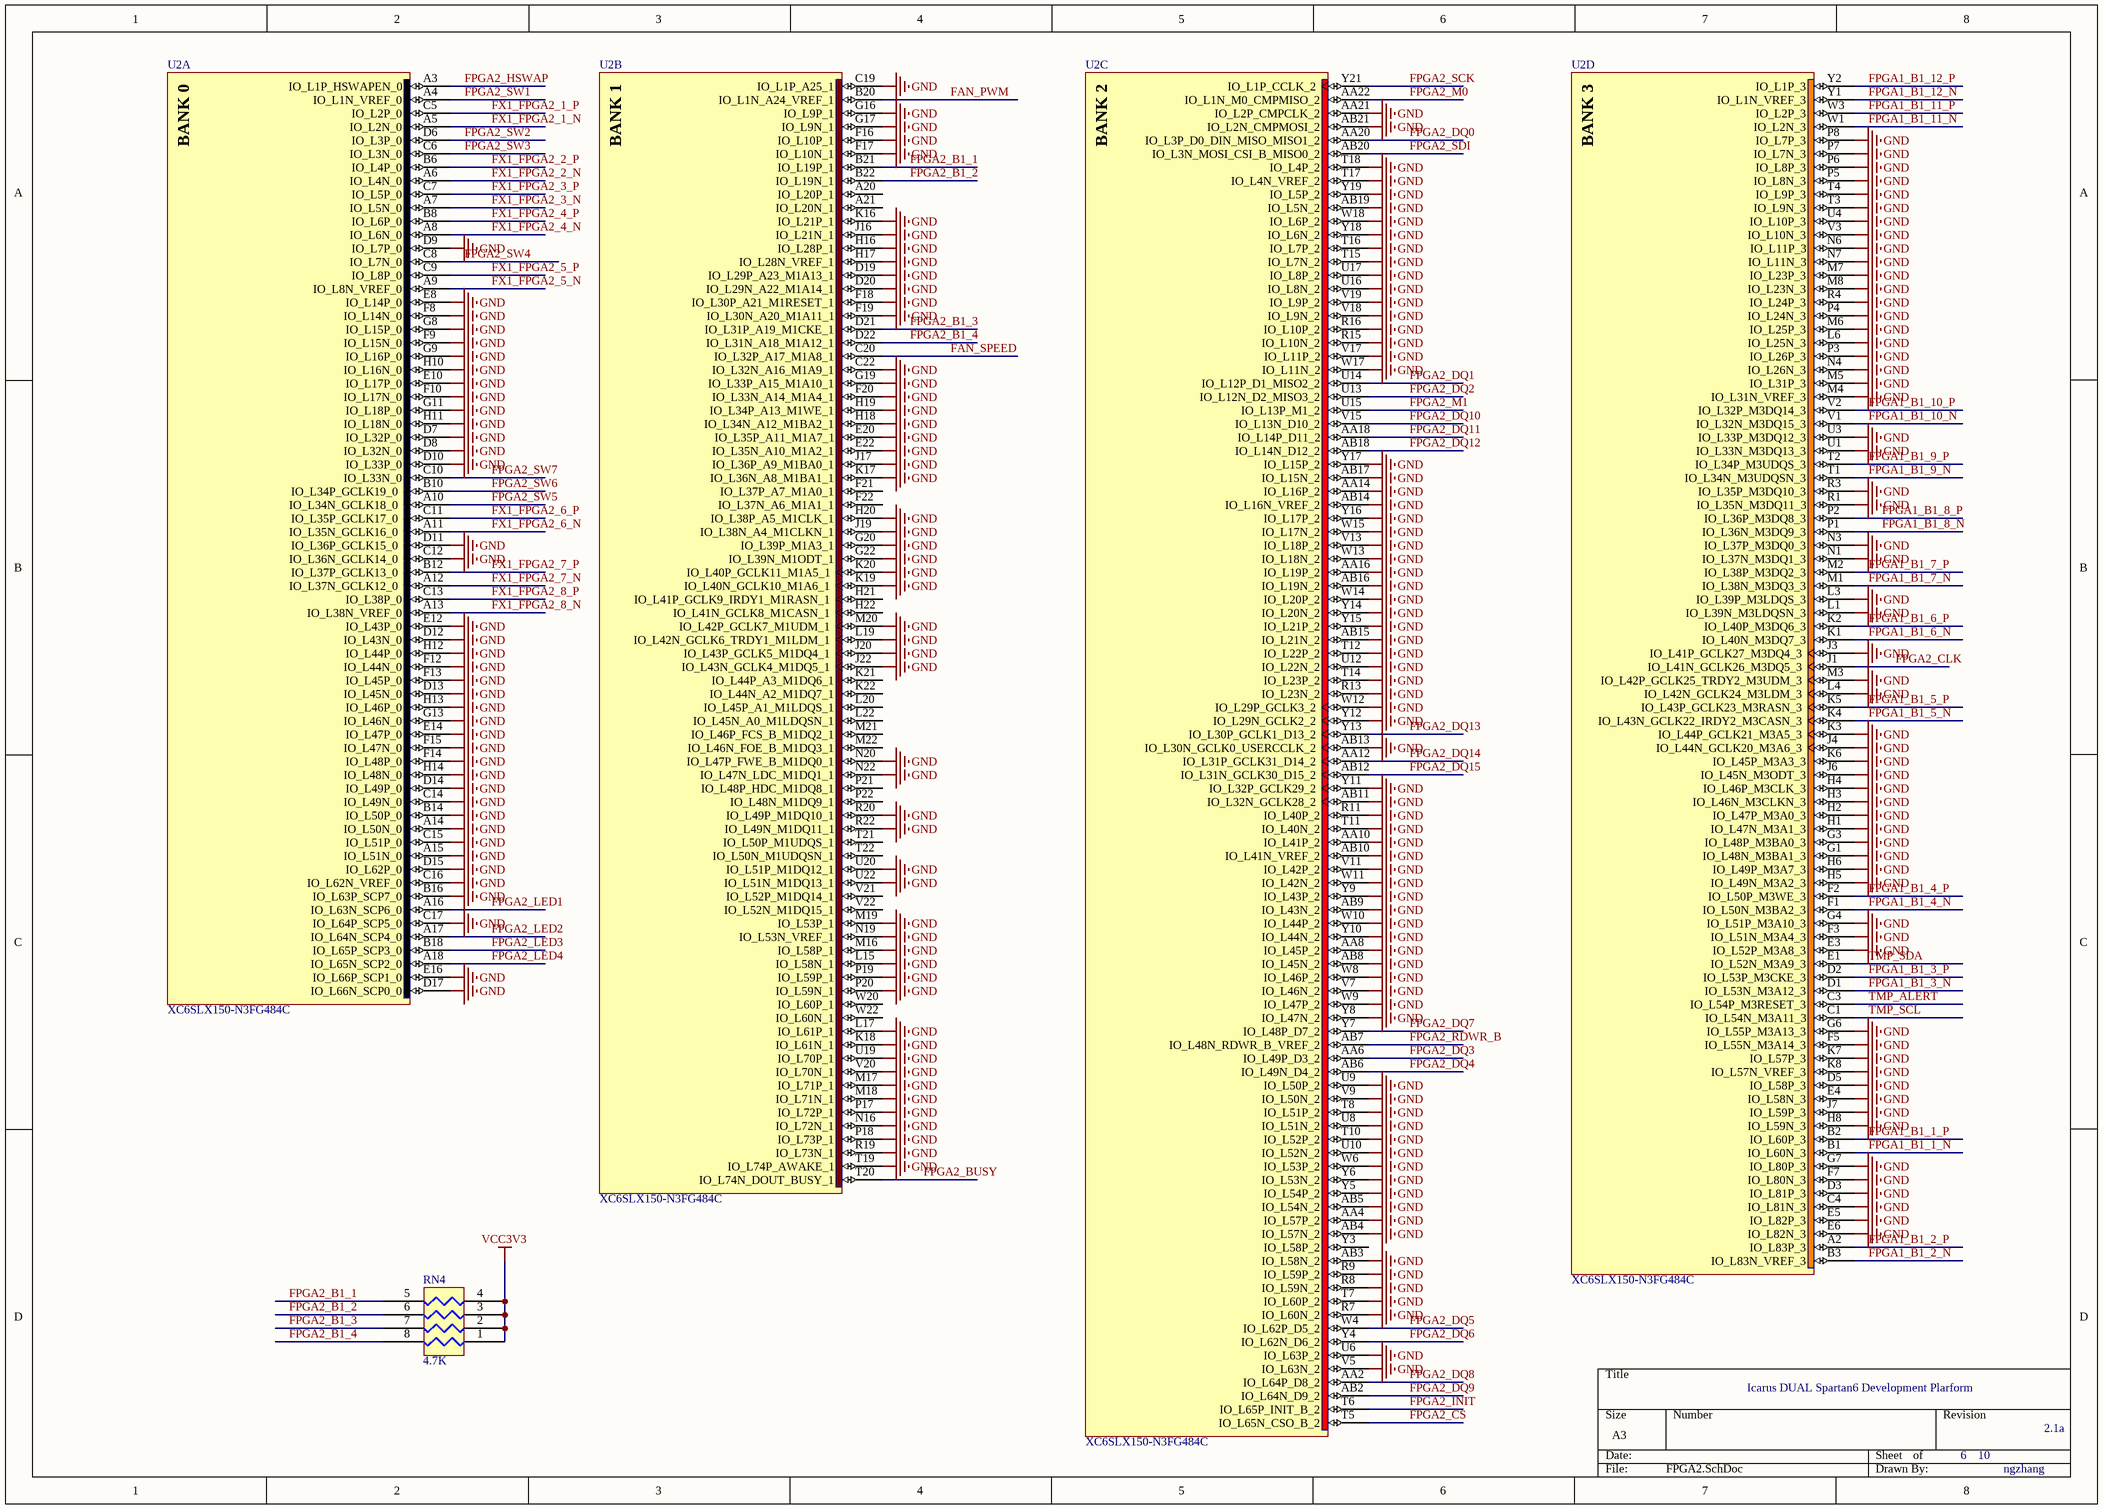
[diagram p7: FPGA2.SchDoc]

### Parts
RN4  4.7K  [EXBV8V]
U2  XC6SLX150-N3FG484C  [FG484]  (parts A,B,C,D of 7)

### Nets
GND: U2.A14(IO_L50N_0) U2.A15(IO_L51N_0) U2.AA4(IO_L57P_2) U2.AA8(IO_L45P_2) U2.AA10(IO_L41P_2) U2.AA14(IO_L16P_2) U2.AA16(IO_L19P_2) U2.AA21(IO_L2P_CMPCLK_2) U2.AB3(IO_L58N_2) U2.AB4(IO_L57N_2) U2.AB5(IO_L54N_2) U2.AB8(IO_L45N_2) U2.AB9(IO_L43N_2) U2.AB10(IO_L41N_VREF_2) U2.AB11(IO_L32N_GCLK28_2) U2.AB13(IO_L30N_GCLK0_USERCCLK_2) U2.AB14(IO_L16N_VREF_2) U2.AB15(IO_L21N_2) U2.AB16(IO_L19N_2) U2.AB17(IO_L15N_2) U2.AB19(IO_L5N_2) U2.AB21(IO_L2N_CMPMOSI_2) U2.B14(IO_L50P_0) U2.B16(IO_L63P_SCP7_0) U2.C4(IO_L81N_3) U2.C12(IO_L36N_GCLK14_0) U2.C14(IO_L49N_0) U2.C15(IO_L51P_0) U2.C16(IO_L62N_VREF_0) U2.C17(IO_L64P_SCP5_0) U2.C19(IO_L1P_A25_1) U2.C22(IO_L32N_A16_M1A9_1) U2.D3(IO_L81P_3) U2.D5(IO_L58P_3) U2.D7(IO_L32P_0) U2.D8(IO_L32N_0) U2.D9(IO_L7P_0) U2.D10(IO_L33P_0) U2.D11(IO_L36P_GCLK15_0) U2.D12(IO_L43N_0) U2.D13(IO_L45N_0) U2.D14(IO_L49P_0) U2.D15(IO_L62P_0) U2.D17(IO_L66N_SCP0_0) U2.D19(IO_L29P_A23_M1A13_1) U2.D20(IO_L29N_A22_M1A14_1) U2.E3(IO_L52P_M3A8_3) U2.E4(IO_L58N_3) U2.E5(IO_L82P_3) U2.E6(IO_L82N_3) U2.E8(IO_L14P_0) U2.E10(IO_L17P_0) U2.E12(IO_L43P_0) U2.E14(IO_L47P_0) U2.E16(IO_L66P_SCP1_0) U2.E20(IO_L35P_A11_M1A7_1) U2.E22(IO_L35N_A10_M1A2_1) U2.F3(IO_L51N_M3A4_3) U2.F5(IO_L55N_M3A14_3) U2.F7(IO_L80N_3) U2.F8(IO_L14N_0) U2.F9(IO_L15N_0) U2.F10(IO_L17N_0) U2.F12(IO_L44N_0) U2.F13(IO_L45P_0) U2.F14(IO_L48P_0) U2.F15(IO_L47N_0) U2.F16(IO_L10P_1) U2.F17(IO_L10N_1) U2.F18(IO_L30P_A21_M1RESET_1) U2.F19(IO_L30N_A20_M1A11_1) U2.F20(IO_L33N_A14_M1A4_1) U2.G1(IO_L48N_M3BA1_3) U2.G3(IO_L48P_M3BA0_3) U2.G4(IO_L51P_M3A10_3) U2.G6(IO_L55P_M3A13_3) U2.G7(IO_L80P_3) U2.G8(IO_L15P_0) U2.G9(IO_L16P_0) U2.G11(IO_L18P_0) U2.G13(IO_L46N_0) U2.G16(IO_L9P_1) U2.G17(IO_L9N_1) U2.G19(IO_L33P_A15_M1A10_1) U2.G20(IO_L39P_M1A3_1) U2.G22(IO_L39N_M1ODT_1) U2.H1(IO_L47N_M3A1_3) U2.H2(IO_L47P_M3A0_3) U2.H3(IO_L46N_M3CLKN_3) U2.H4(IO_L46P_M3CLK_3) U2.H5(IO_L49N_M3A2_3) U2.H6(IO_L49P_M3A7_3) U2.H8(IO_L59N_3) U2.H10(IO_L16N_0) U2.H11(IO_L18N_0) U2.H12(IO_L44P_0) U2.H13(IO_L46P_0) U2.H14(IO_L48N_0) U2.H16(IO_L28P_1) U2.H17(IO_L28N_VREF_1) U2.H18(IO_L34N_A12_M1BA2_1) U2.H19(IO_L34P_A13_M1WE_1) U2.H20(IO_L38P_A5_M1CLK_1) U2.J3(IO_L41P_GCLK27_M3DQ4_3) U2.J4(IO_L44N_GCLK20_M3A6_3) U2.J6(IO_L45N_M3ODT_3) U2.J7(IO_L59P_3) U2.J16(IO_L21N_1) U2.J17(IO_L36P_A9_M1BA0_1) U2.J19(IO_L38N_A4_M1CLKN_1) U2.J20(IO_L43P_GCLK5_M1DQ4_1) U2.J22(IO_L43N_GCLK4_M1DQ5_1) U2.K3(IO_L44P_GCLK21_M3A5_3) U2.K6(IO_L45P_M3A3_3) U2.K7(IO_L57P_3) U2.K8(IO_L57N_VREF_3) U2.K16(IO_L21P_1) U2.K17(IO_L36N_A8_M1BA1_1) U2.K18(IO_L61N_1) U2.K19(IO_L40N_GCLK10_M1A6_1) U2.K20(IO_L40P_GCLK11_M1A5_1) U2.L1(IO_L39N_M3LDQSN_3) U2.L3(IO_L39P_M3LDQS_3) U2.L4(IO_L42N_GCLK24_M3LDM_3) U2.L6(IO_L25N_3) U2.L15(IO_L58N_1) U2.L17(IO_L61P_1) U2.L19(IO_L42N_GCLK6_TRDY1_M1LDM_1) U2.M3(IO_L42P_GCLK25_TRDY2_M3UDM_3) U2.M4(IO_L31N_VREF_3) U2.M5(IO_L31P_3) U2.M6(IO_L25P_3) U2.M7(IO_L23P_3) U2.M8(IO_L23N_3) U2.M16(IO_L58P_1) U2.M17(IO_L71P_1) U2.M18(IO_L71N_1) U2.M19(IO_L53P_1) U2.M20(IO_L42P_GCLK7_M1UDM_1) U2.N1(IO_L37N_M3DQ1_3) U2.N3(IO_L37P_M3DQ0_3) U2.N4(IO_L26N_3) U2.N6(IO_L11P_3) U2.N7(IO_L11N_3) U2.N16(IO_L72N_1) U2.N19(IO_L53N_VREF_1) U2.N20(IO_L47P_FWE_B_M1DQ0_1) U2.N22(IO_L47N_LDC_M1DQ1_1) U2.P3(IO_L26P_3) U2.P4(IO_L24N_3) U2.P5(IO_L8N_3) U2.P6(IO_L8P_3) U2.P7(IO_L7N_3) U2.P8(IO_L7P_3) U2.P17(IO_L72P_1) U2.P18(IO_L73P_1) U2.P19(IO_L59P_1) U2.P20(IO_L59N_1) U2.R1(IO_L35N_M3DQ11_3) U2.R3(IO_L35P_M3DQ10_3) U2.R4(IO_L24P_3) U2.R7(IO_L60N_2) U2.R8(IO_L59N_2) U2.R9(IO_L59P_2) U2.R11(IO_L40P_2) U2.R13(IO_L23N_2) U2.R15(IO_L10N_2) U2.R16(IO_L10P_2) U2.R19(IO_L73N_1) U2.R20(IO_L49P_M1DQ10_1) U2.R22(IO_L49N_M1DQ11_1) U2.T3(IO_L9N_3) U2.T4(IO_L9P_3) U2.T7(IO_L60P_2) U2.T8(IO_L51P_2) U2.T10(IO_L52P_2) U2.T11(IO_L40N_2) U2.T12(IO_L22P_2) U2.T14(IO_L23P_2) U2.T15(IO_L7N_2) U2.T16(IO_L7P_2) U2.T17(IO_L4N_VREF_2) U2.T18(IO_L4P_2) U2.T19(IO_L74P_AWAKE_1) U2.U1(IO_L33N_M3DQ13_3) U2.U3(IO_L33P_M3DQ12_3) U2.U4(IO_L10P_3) U2.U6(IO_L63P_2) U2.U8(IO_L51N_2) U2.U9(IO_L50P_2) U2.U10(IO_L52N_2) U2.U12(IO_L22N_2) U2.U16(IO_L8N_2) U2.U17(IO_L8P_2) U2.U19(IO_L70P_1) U2.U20(IO_L51P_M1DQ12_1) U2.U22(IO_L51N_M1DQ13_1) U2.V3(IO_L10N_3) U2.V5(IO_L63N_2) U2.V7(IO_L46N_2) U2.V9(IO_L50N_2) U2.V11(IO_L42P_2) U2.V13(IO_L18P_2) U2.V17(IO_L11P_2) U2.V18(IO_L9N_2) U2.V19(IO_L9P_2) U2.V20(IO_L70N_1) U2.W6(IO_L53P_2) U2.W8(IO_L46P_2) U2.W9(IO_L47P_2) U2.W10(IO_L44P_2) U2.W11(IO_L42N_2) U2.W12(IO_L29P_GCLK3_2) U2.W13(IO_L18N_2) U2.W14(IO_L20P_2) U2.W15(IO_L17N_2) U2.W17(IO_L11N_2) U2.W18(IO_L6P_2) U2.Y5(IO_L54P_2) U2.Y6(IO_L53N_2) U2.Y8(IO_L47N_2) U2.Y9(IO_L43P_2) U2.Y10(IO_L44N_2) U2.Y11(IO_L32P_GCLK29_2) U2.Y12(IO_L29N_GCLK2_2) U2.Y14(IO_L20N_2) U2.Y15(IO_L21P_2) U2.Y16(IO_L17P_2) U2.Y17(IO_L15P_2) U2.Y18(IO_L6N_2) U2.Y19(IO_L5P_2)
VCC3V3: RN4.1 RN4.2 RN4.3 RN4.4
FAN_PWM: U2.B20(IO_L1N_A24_VREF_1)
FAN_SPEED: U2.C20(IO_L32P_A17_M1A8_1)
FPGA1_B1_1_N: U2.B1(IO_L60N_3)
FPGA1_B1_1_P: U2.B2(IO_L60P_3)
FPGA1_B1_2_N: U2.B3(IO_L83N_VREF_3)
FPGA1_B1_2_P: U2.A2(IO_L83P_3)
FPGA1_B1_3_N: U2.D1(IO_L53N_M3A12_3)
FPGA1_B1_3_P: U2.D2(IO_L53P_M3CKE_3)
FPGA1_B1_4_N: U2.F1(IO_L50N_M3BA2_3)
FPGA1_B1_4_P: U2.F2(IO_L50P_M3WE_3)
FPGA1_B1_5_N: U2.K4(IO_L43N_GCLK22_IRDY2_M3CASN_3)
FPGA1_B1_5_P: U2.K5(IO_L43P_GCLK23_M3RASN_3)
FPGA1_B1_6_N: U2.K1(IO_L40N_M3DQ7_3)
FPGA1_B1_6_P: U2.K2(IO_L40P_M3DQ6_3)
FPGA1_B1_7_N: U2.M1(IO_L38N_M3DQ3_3)
FPGA1_B1_7_P: U2.M2(IO_L38P_M3DQ2_3)
FPGA1_B1_8_N: U2.P1(IO_L36N_M3DQ9_3)
FPGA1_B1_8_P: U2.P2(IO_L36P_M3DQ8_3)
FPGA1_B1_9_N: U2.T1(IO_L34N_M3UDQSN_3)
FPGA1_B1_9_P: U2.T2(IO_L34P_M3UDQS_3)
FPGA1_B1_10_N: U2.V1(IO_L32N_M3DQ15_3)
FPGA1_B1_10_P: U2.V2(IO_L32P_M3DQ14_3)
FPGA1_B1_11_N: U2.W1(IO_L2N_3)
FPGA1_B1_11_P: U2.W3(IO_L2P_3)
FPGA1_B1_12_N: U2.Y1(IO_L1N_VREF_3)
FPGA1_B1_12_P: U2.Y2(IO_L1P_3)
FPGA2_B1_1: RN4.5 U2.B21(IO_L19P_1)
FPGA2_B1_2: RN4.6 U2.B22(IO_L19N_1)
FPGA2_B1_3: RN4.7 U2.D21(IO_L31P_A19_M1CKE_1)
FPGA2_B1_4: RN4.8 U2.D22(IO_L31N_A18_M1A12_1)
FPGA2_BUSY: U2.T20(IO_L74N_DOUT_BUSY_1)
FPGA2_CLK: U2.J1(IO_L41N_GCLK26_M3DQ5_3)
FPGA2_CS: U2.T5(IO_L65N_CSO_B_2)
FPGA2_DQ0: U2.AA20(IO_L3P_D0_DIN_MISO_MISO1_2)
FPGA2_DQ1: U2.U14(IO_L12P_D1_MISO2_2)
FPGA2_DQ2: U2.U13(IO_L12N_D2_MISO3_2)
FPGA2_DQ3: U2.AA6(IO_L49P_D3_2)
FPGA2_DQ4: U2.AB6(IO_L49N_D4_2)
FPGA2_DQ5: U2.W4(IO_L62P_D5_2)
FPGA2_DQ6: U2.Y4(IO_L62N_D6_2)
FPGA2_DQ7: U2.Y7(IO_L48P_D7_2)
FPGA2_DQ8: U2.AA2(IO_L64P_D8_2)
FPGA2_DQ9: U2.AB2(IO_L64N_D9_2)
FPGA2_DQ10: U2.V15(IO_L13N_D10_2)
FPGA2_DQ11: U2.AA18(IO_L14P_D11_2)
FPGA2_DQ12: U2.AB18(IO_L14N_D12_2)
FPGA2_DQ13: U2.Y13(IO_L30P_GCLK1_D13_2)
FPGA2_DQ14: U2.AA12(IO_L31P_GCLK31_D14_2)
FPGA2_DQ15: U2.AB12(IO_L31N_GCLK30_D15_2)
FPGA2_HSWAP: U2.A3(IO_L1P_HSWAPEN_0)
FPGA2_INIT: U2.T6(IO_L65P_INIT_B_2)
FPGA2_LED1: U2.A16(IO_L63N_SCP6_0)
FPGA2_LED2: U2.A17(IO_L64N_SCP4_0)
FPGA2_LED3: U2.B18(IO_L65P_SCP3_0)
FPGA2_LED4: U2.A18(IO_L65N_SCP2_0)
FPGA2_M0: U2.AA22(IO_L1N_M0_CMPMISO_2)
FPGA2_M1: U2.U15(IO_L13P_M1_2)
FPGA2_RDWR_B: U2.AB7(IO_L48N_RDWR_B_VREF_2)
FPGA2_SCK: U2.Y21(IO_L1P_CCLK_2)
FPGA2_SDI: U2.AB20(IO_L3N_MOSI_CSI_B_MISO0_2)
FPGA2_SW1: U2.A4(IO_L1N_VREF_0)
FPGA2_SW2: U2.D6(IO_L3P_0)
FPGA2_SW3: U2.C6(IO_L3N_0)
FPGA2_SW4: U2.C8(IO_L7N_0)
FPGA2_SW5: U2.A10(IO_L34N_GCLK18_0)
FPGA2_SW6: U2.B10(IO_L34P_GCLK19_0)
FPGA2_SW7: U2.C10(IO_L33N_0)
FX1_FPGA2_1_N: U2.A5(IO_L2N_0)
FX1_FPGA2_1_P: U2.C5(IO_L2P_0)
FX1_FPGA2_2_N: U2.A6(IO_L4N_0)
FX1_FPGA2_2_P: U2.B6(IO_L4P_0)
FX1_FPGA2_3_N: U2.A7(IO_L5N_0)
FX1_FPGA2_3_P: U2.C7(IO_L5P_0)
FX1_FPGA2_4_N: U2.A8(IO_L6N_0)
FX1_FPGA2_4_P: U2.B8(IO_L6P_0)
FX1_FPGA2_5_N: U2.A9(IO_L8N_VREF_0)
FX1_FPGA2_5_P: U2.C9(IO_L8P_0)
FX1_FPGA2_6_N: U2.A11(IO_L35N_GCLK16_0)
FX1_FPGA2_6_P: U2.C11(IO_L35P_GCLK17_0)
FX1_FPGA2_7_N: U2.A12(IO_L37N_GCLK12_0)
FX1_FPGA2_7_P: U2.B12(IO_L37P_GCLK13_0)
FX1_FPGA2_8_N: U2.A13(IO_L38N_VREF_0)
FX1_FPGA2_8_P: U2.C13(IO_L38P_0)
TMP_ALERT: U2.C3(IO_L54P_M3RESET_3)
TMP_SCL: U2.C1(IO_L54N_M3A11_3)
TMP_SDA: U2.E1(IO_L52N_M3A9_3)

Not connected (* = marked no-connect by the designer): U2 A20(IO_L20P_1) A21(IO_L20N_1) F21(IO_L37P_A7_M1A0_1) F22(IO_L37N_A6_M1A1_1) H21(IO_L41P_GCLK9_IRDY1_M1RASN_1) H22(IO_L41N_GCLK8_M1CASN_1) K21(IO_L44P_A3_M1DQ6_1) K22(IO_L44N_A2_M1DQ7_1) L20(IO_L45P_A1_M1LDQS_1) L22(IO_L45N_A0_M1LDQSN_1) M21(IO_L46P_FCS_B_M1DQ2_1) M22(IO_L46N_FOE_B_M1DQ3_1) P21(IO_L48P_HDC_M1DQ8_1) P22(IO_L48N_M1DQ9_1) T21(IO_L50P_M1UDQS_1) T22(IO_L50N_M1UDQSN_1) V21(IO_L52P_M1DQ14_1) V22(IO_L52N_M1DQ15_1) W20(IO_L60P_1) W22(IO_L60N_1) Y3(IO_L58P_2)

### Notes on the sheet
- Icarus DUAL Spartan6 Development Plarform
- 6
- 10
- 2.1a
- ngzhang
- (in symbol XC6SLX150-N3FG484C, part A) BANK 0
- (in symbol XC6SLX150-N3FG484C, part B) BANK 1
- (in symbol XC6SLX150-N3FG484C, part C) BANK 2
- (in symbol XC6SLX150-N3FG484C, part D) BANK 3

### Library data of the parts
RN4 = RES4PACK
U2 = XC6SLX150-N3FG484C: as U1 on sheet config; Published: 24-Aug-2010; DatasheetVersion: ver1.6, Nov-2010; PackageVersion: ver1.1, Dec-2008; PackageReference: FG484; Publisher: Altium Limited; PackageDescription: 484-Ball Fine Pitch Ball Grid Array 1.00 mm Pitch (FG484); Code_JEDEC: MS-034-AAJ-1; Code_IPC: BGA100P22X22-484; ComponentLink1Description: Manufacturer Link; ComponentLink1URL: http://www.xilinx.com; ComponentLink2Description: Spartan-6 Datasheet; ComponentLink2URL: http://www.xilinx.com/support/documentation/data_sheets/ds160.pdf; ComponentLink3Description: Spartan-6 Documents; ComponentLink3URL: http://www.xilinx.com/support/documentation/spartan-6.htm; ComponentLink4Description: Xilinx.com Home; ComponentLink4URL: http://www.xilinx.com